# EAGLE design BEP33_2panel_v2b (EAGLE 7.7.0)
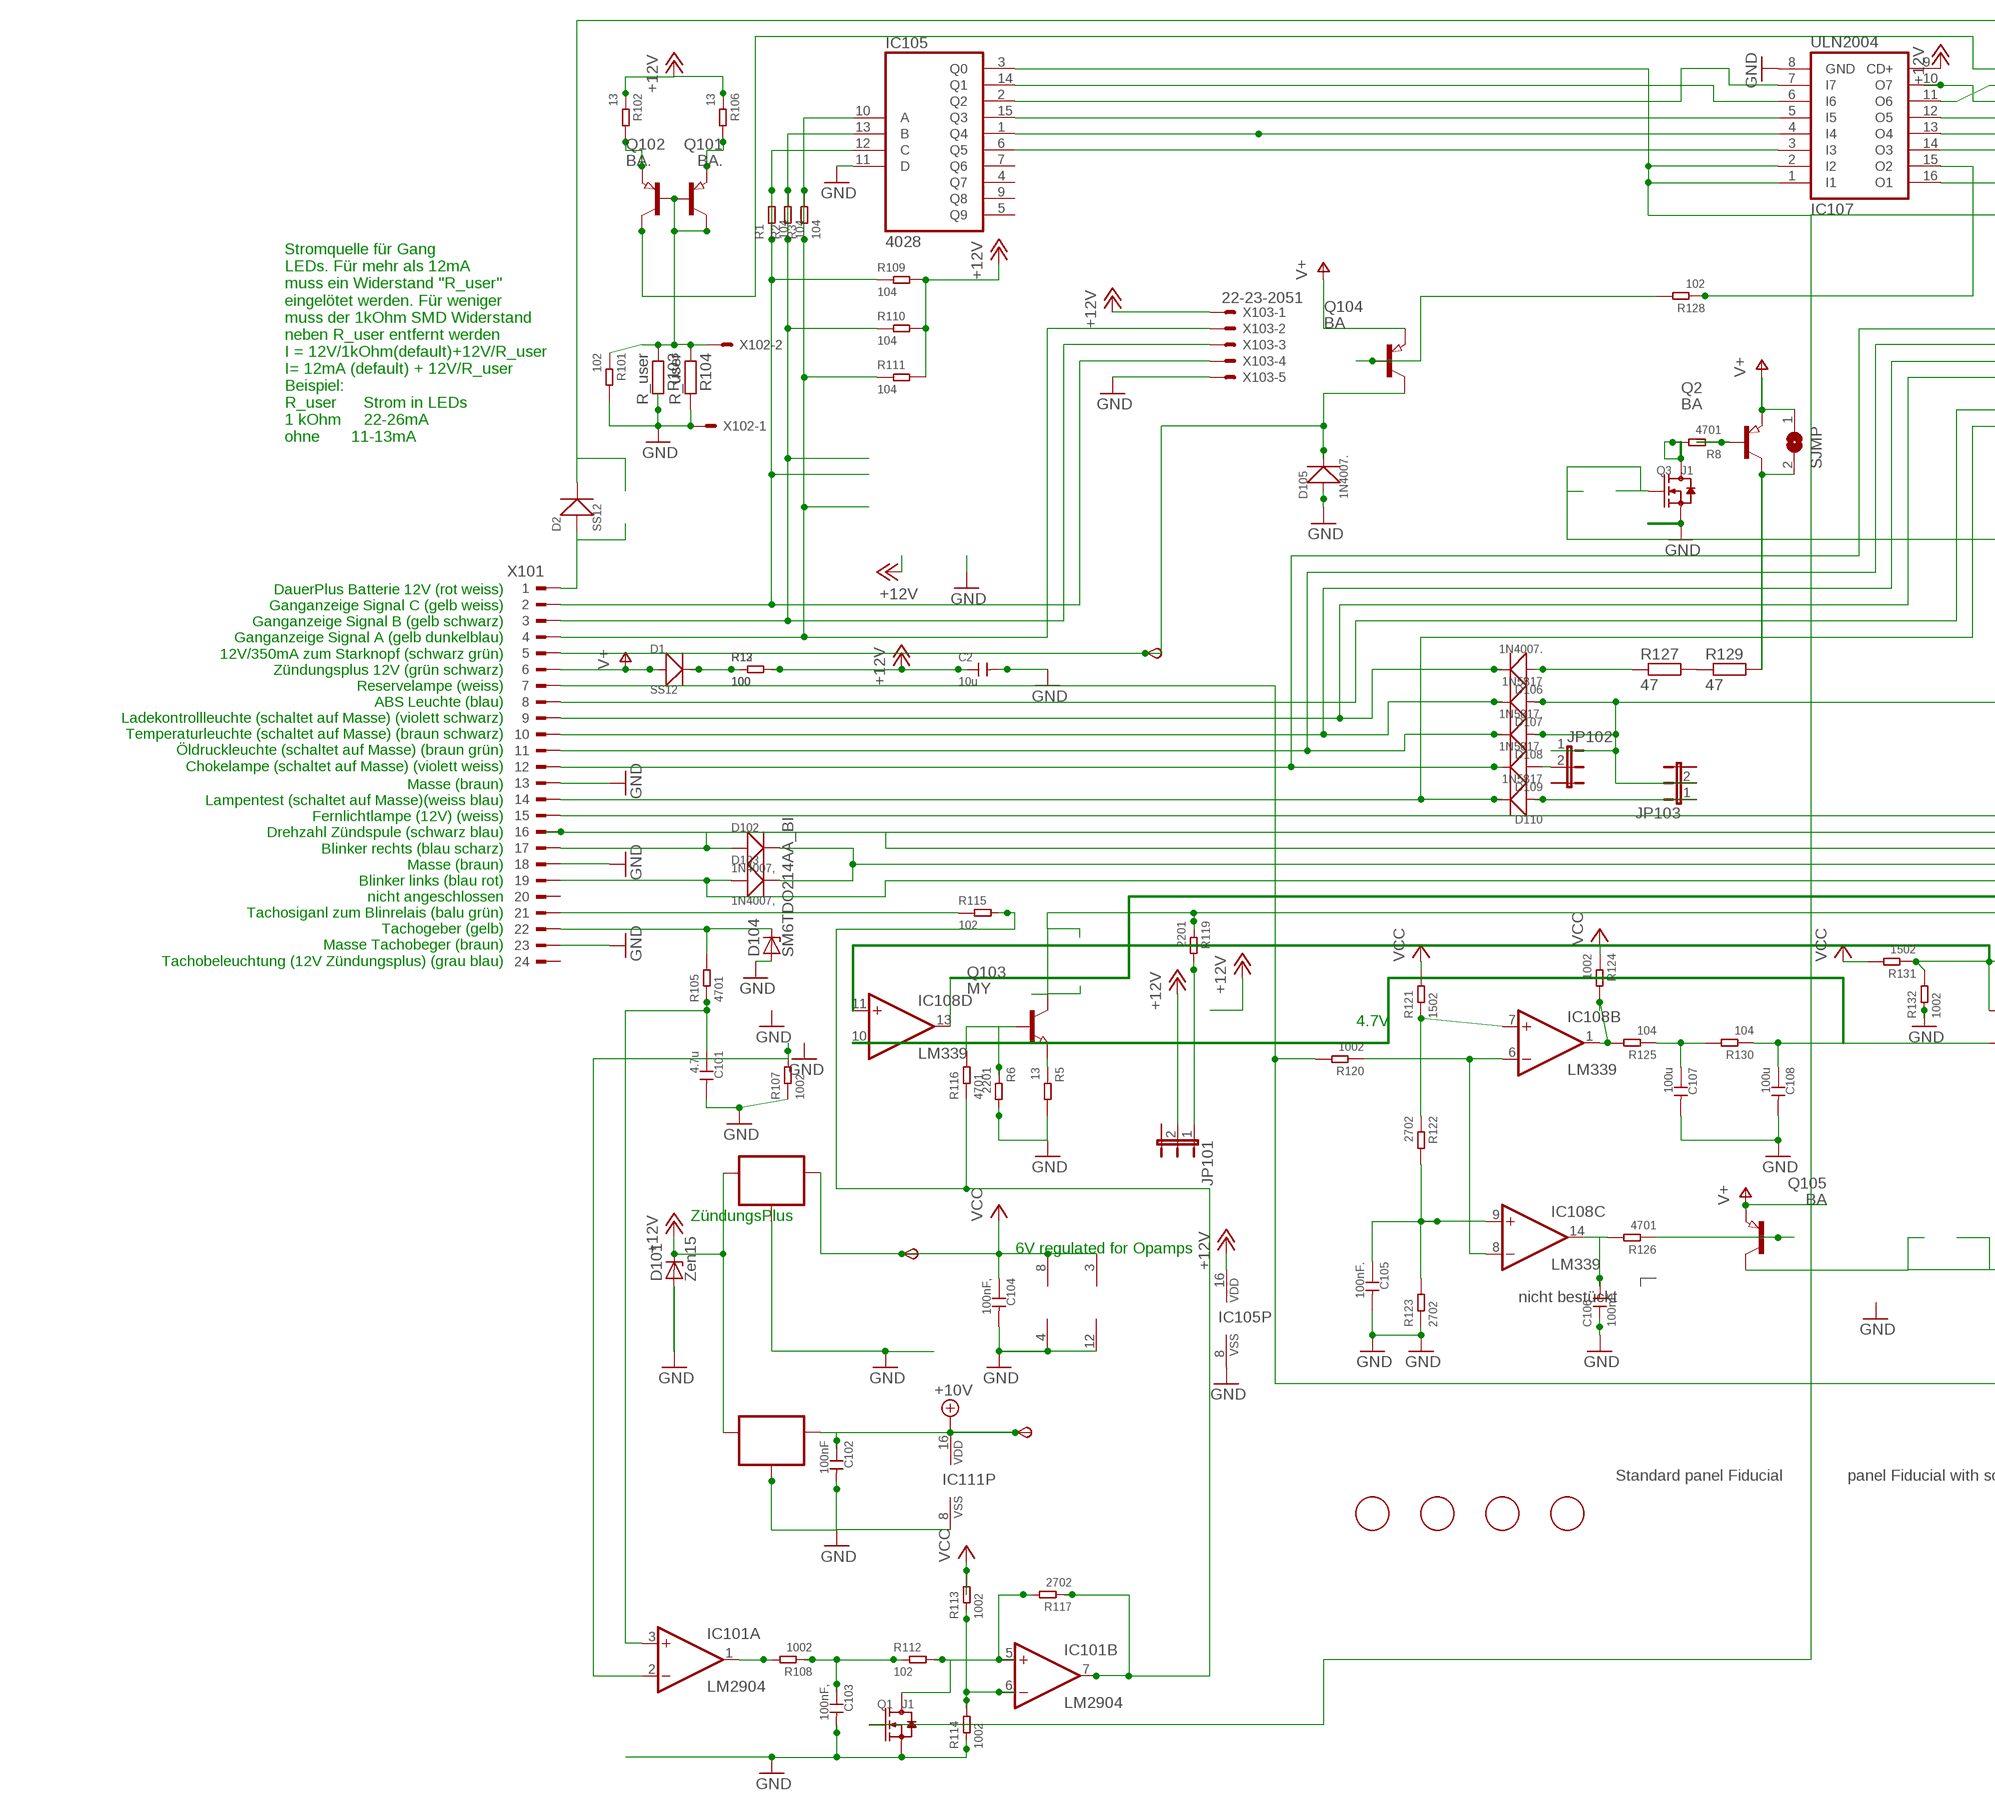
[diagram p0: schematic, sheet 1, part 1 of 2]
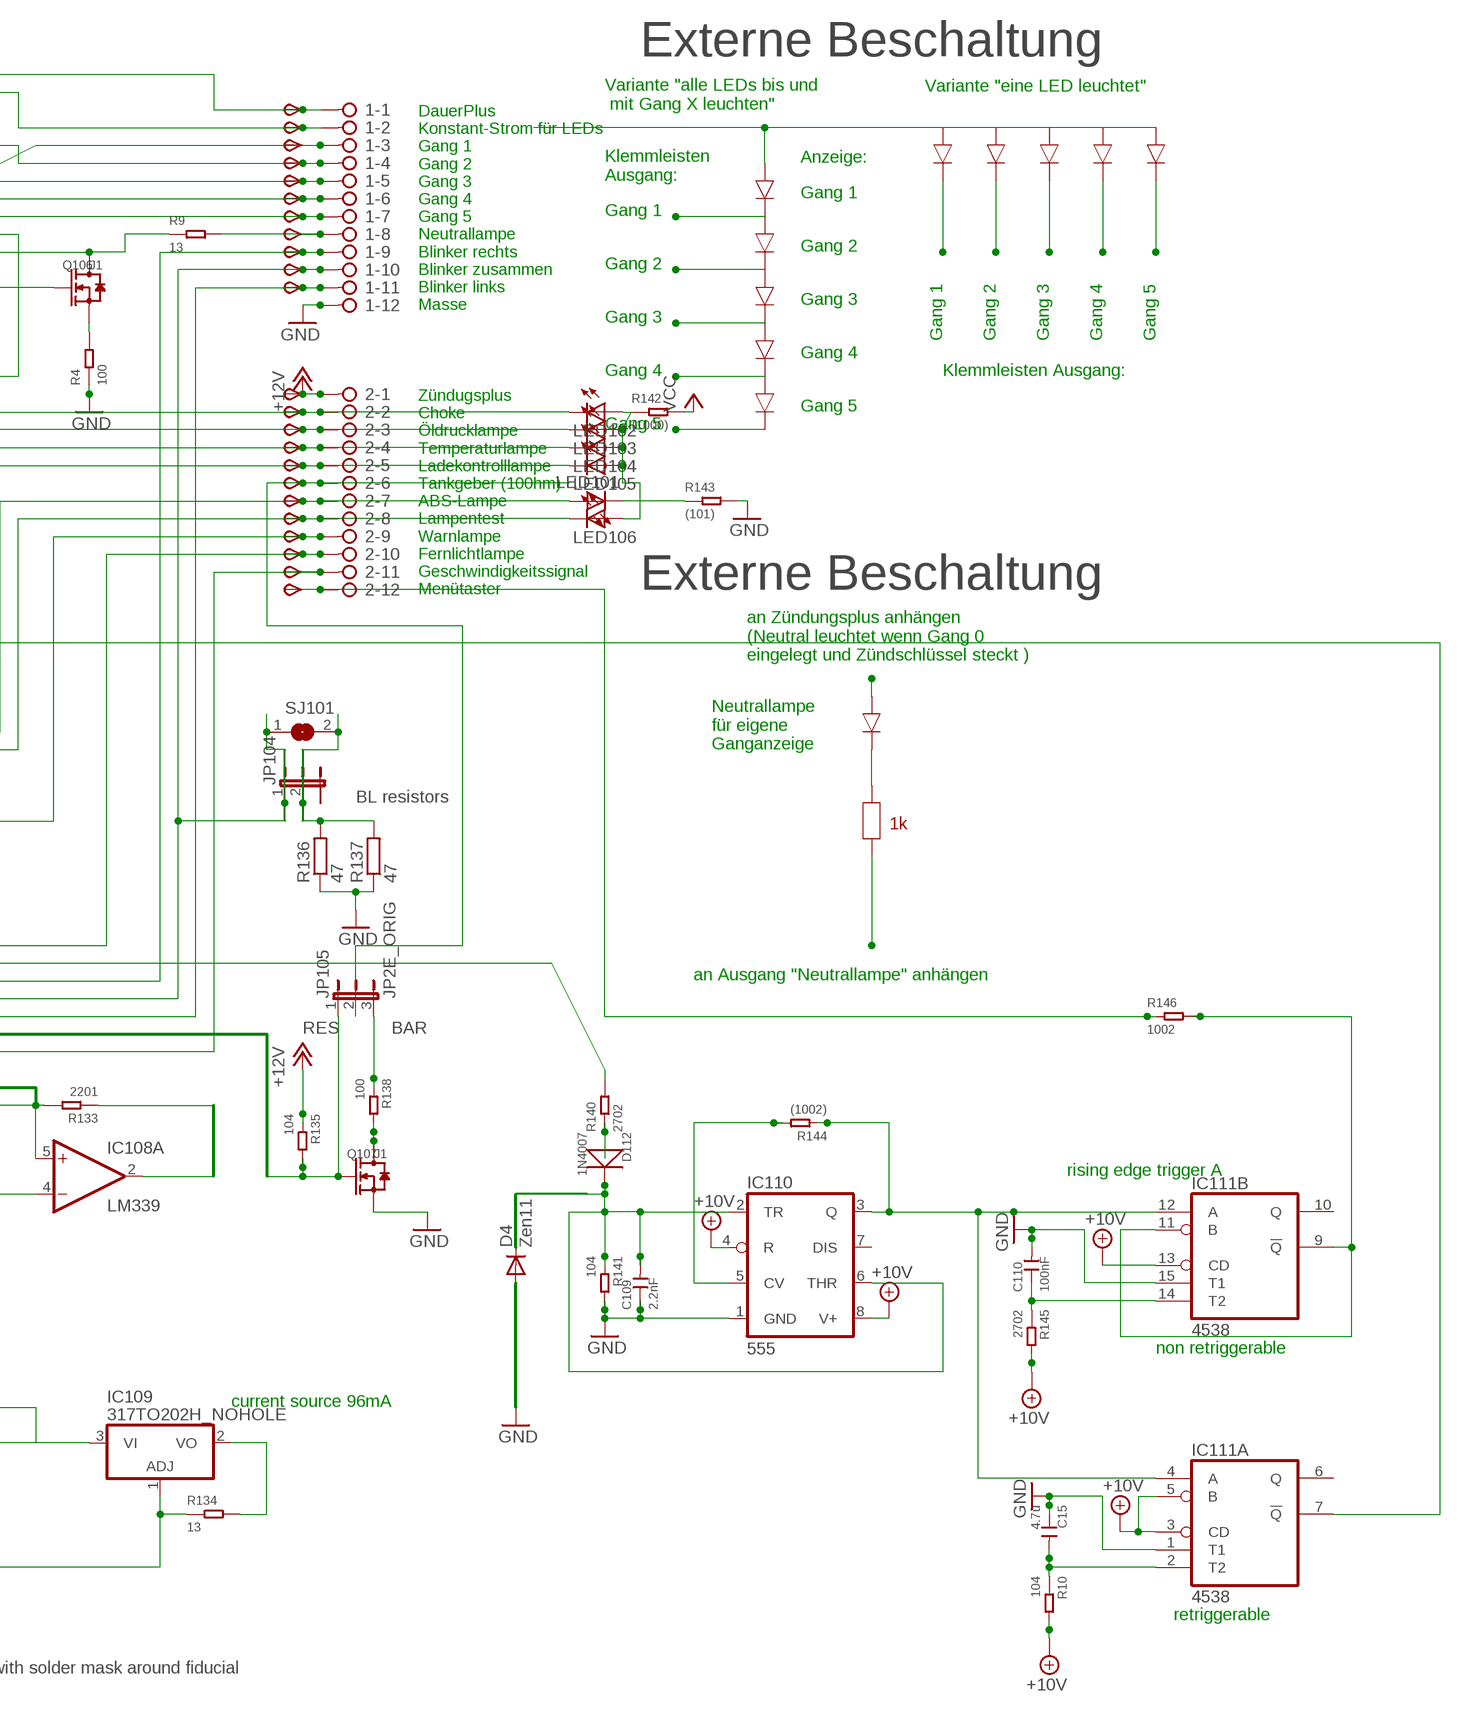
[diagram p1: schematic, sheet 1, part 2 of 2]

## Parts
1  2081-1132  [12-PIN]
2  2081-1132  [12-PIN]
6V  TPSB2.0  [B2.0]
10V  TPSB2.0  [B2.0]
C2  10u  CERAMIC-100UF-6.3V-20%-X5R(1206)  [C1206]
C15  4.7u  CERAMIC-4.7UF-25V-10%-X5R(0805)  [C0805]
C101  4.7u  CERAMIC-4.7UF-25V-10%-X5R(0805)  [C0805]
C102  100nF  CERAMIC-100NF-50V-10%-X7R(0805)  [C0805]
C103  100nF,  CERAMIC-100NF-50V-10%-X7R(0805)  [C0805]
C104  100nF,  CERAMIC-100NF-50V-10%-X7R(0805)  [C0805]
C105  100nF.  CERAMIC-100NF-50V-10%-X7R(0805)  [C0805]
C106  100nF.  CERAMIC-100NF-50V-10%-X7R(0805)  [C0805]
C107  100u  CERAMIC-100UF-6.3V-20%-X5R(1206)  [C1206]
C108  100u  CERAMIC-100UF-6.3V-20%-X5R(1206)  [C1206]
C109  2.2nF  CERAMIC-100NF-50V-10%-X7R(0805)  [C0805]
C110  100nF  CERAMIC-100NF-50V-10%-X7R(0805)  [C0805]
D1  SS12  DIODE-GEN-PURPOSE-1KV-1A(DO-214AC)DO-214AC/1206  [DO-214AC_SLIM]
D2  SS12  DIODE-GEN-PURPOSE-1KV-1A(DO-214AC)DO-214AC/1206  [DO-214AC_SLIM]
D4  Zen11  CGRM4001-G  [SOD-123_MINI-SMA]
D101  Zen15  SM6T  [DO214AA]
D102  1N4007,  DIODE-GEN-PURPOSE-1KV-1A(DO-214AC)  [DO-214AC]
D103  1N4007,  DIODE-GEN-PURPOSE-1KV-1A(DO-214AC)  [DO-214AC]
D104  SM6TDO214AA_BI  [DO214AA_BI]
D105  1N4007.  DIODE-GEN-PURPOSE-1KV-1A(DO-214AC)  [DO-214AC]
D106  1N4007.  DIODE-GEN-PURPOSE-1KV-1A(DO-214AC)  [DO-214AC]
D107  1N5817  DIODE-GEN-PURPOSE-1KV-1A(DO-214AC)DO-214AC/1206  [DO-214AC_SLIM]
D108  1N5817.  DIODE-GEN-PURPOSE-1KV-1A(DO-214AC)DO-214AC/1206  [DO-214AC_SLIM]
D109  1N5817.  DIODE-GEN-PURPOSE-1KV-1A(DO-214AC)DO-214AC/1206  [DO-214AC_SLIM]
D110  1N5817  DIODE-GEN-PURPOSE-1KV-1A(DO-214AC)DO-214AC/1206  [DO-214AC_SLIM]
D112  1N4007  DIODE-GEN-PURPOSE-1KV-1A(DO-214AC)  [DO-214AC]
FID101  FIDUCIAL  [FIDUCIAL_1MM]
FID102  FIDUCIAL  [FIDUCIAL_1MM]
FID103  FIDUCIAL  [FIDUCIAL_1MM]
FID104  FIDUCIAL  [FIDUCIAL_1MM]
IC101  LM2904  LM358D  [SO08]
IC102  78L06  78LXXSOT89_ROUND  [SOT89_ROUND]
IC104  78L10  78LXXSOT89_ROUND  [SOT89_ROUND]
IC105  4028  4028D  [SO16]
IC107  ULN2004  ULN2004AD  [SO16]
IC108  LM339  LM339D  [SO14]
IC109  317TO202H_NOHOLE  [TO220H_NOHOLE]
IC110  555  NE555D  [SO08]
IC111  4538  4538D  [SO16]
JP101  JP2EJP2_SMALLPADS  [JP2_SMALLPADS]
JP102  JP2EJP2_SMALLPADS  [JP2_SMALLPADS]
JP103  JP2EJP2_SMALLPADS  [JP2_SMALLPADS]
JP104  JP2EJP2_SMALLPADS  [JP2_SMALLPADS]
JP105  JP2E_ORIG  [JP2_ORIG_SMALLPADS]
LED101  LEDLD260  [LD260]
LED102  LEDLD260  [LD260]
LED103  LEDLD260  [LD260]
LED104  LEDLD260  [LD260]
LED105  LEDLD260  [LD260]
LED106  LEDLD260  [LD260]
Q1  J1  SMD-MOSFET-N-CH-50V-200MA-BSS138W-7-F(SOT-23)  [SOT-23]
Q2  BA  PNP-TRANSISTOR_SOT89  [SOT89]
Q3  J1  SMD-MOSFET-N-CH-50V-200MA-BSS138W-7-F(SOT-23)  [SOT-23]
Q101  BA.  PNP-TRANSISTOR_SOT89  [SOT89]
Q102  BA.  PNP-TRANSISTOR_SOT89  [SOT89]
Q103  MY  NPN-TRANSISTOR_SOT89  [SOT89]
Q104  BA  PNP-TRANSISTOR_SOT89  [SOT89]
Q105  BA  PNP-TRANSISTOR_SOT89  [SOT89]
Q106  J1  SMD-MOSFET-N-CH-50V-200MA-BSS138W-7-F(SOT-23)  [SOT-23]
Q107  J1  SMD-MOSFET-N-CH-50V-200MA-BSS138W-7-F(SOT-23)  [SOT-23]
R1  104  SMD-RES-10K-1%-1/8W(0805)  [R0805]
R2  104  SMD-RES-10K-1%-1/8W(0805)  [R0805]
R3  104  SMD-RES-10K-1%-1/8W(0805)  [R0805]
R4  100  SMD-RES-220R-5%-1/8W(0805)  [R0805]
R5  13  SMD-RES-13R-5%-1/4W(1206)  [R1206]
R6  2201  SMD-RES-1K-5%-1/8W(0805)  [R0805]
R8  4701  SMD-RES-4.7K-5%-1/8W(0805)  [R0805]
R9  13  SMD-RES-13R-5%-1/4W(1206)  [R1206]
R10  104  SMD-RES-4.7K-5%-1/8W(0805)  [R0805]
R12  100  SMD-RES-2.2K-5%-1/8W(0805)  [R0805]
R13  100  SMD-RES-2.2K-5%-1/8W(0805)  [R0805]
R101  102  SMD-RES-1K-5%-1/8W(0805)  [R0805]
R102  13  SMD-RES-13R-5%-1/4W(1206)  [R1206]
R103  R_user  R-EU_R0805  [R0805]
R104  R_user  R-EU_R0805  [R0805]
R105  4701  SMD-RES-4.7K-5%-1/8W(0805)  [R0805]
R106  13  SMD-RES-13R-5%-1/4W(1206)  [R1206]
R107  1002  SMD-RES-10K-1%-1/8W(0805)  [R0805]
R108  1002  SMD-RES-10K-1%-1/8W(0805)  [R0805]
R109  104  SMD-RES-10K-1%-1/8W(0805)  [R0805]
R110  104  SMD-RES-10K-1%-1/8W(0805)  [R0805]
R111  104  SMD-RES-10K-1%-1/8W(0805)  [R0805]
R112  102  SMD-RES-1K-5%-1/8W(0805)  [R0805]
R113  1002  SMD-RES-1K-5%-1/8W(0805)  [R0805]
R114  1002  SMD-RES-1K-5%-1/8W(0805)  [R0805]
R115  102  SMD-RES-220R-5%-1/8W(0805)  [R0805]
R116  4701  SMD-RES-4.7K-5%-1/8W(0805)  [R0805]
R117  2702  SMD-RES-4.7K-5%-1/8W(0805)  [R0805]
R119  2201  SMD-RES-2.2K-5%-1/8W(0805)  [R0805]
R120  1002  SMD-RES-10K-1%-1/8W(0805)  [R0805]
R121  1502  SMD-RES-10K-1%-1/8W(0805)  [R0805]
R122  2702  SMD-RES-4.7K-5%-1/8W(0805)  [R0805]
R123  2702  SMD-RES-4.7K-5%-1/8W(0805)  [R0805]
R124  1002  SMD-RES-10K-1%-1/8W(0805)  [R0805]
R125  104  SMD-RES-10K-1%-1/8W(0805)  [R0805]
R126  4701  SMD-RES-4.7K-5%-1/8W(0805)  [R0805]
R127  47  R-EU_V235/17_1MM  [V235/17_1MM]
R128  102  SMD-RES-1K-5%-1/8W(0805)  [R0805]
R129  47  R-EU_V235/17_1MM  [V235/17_1MM]
R130  104  SMD-RES-10K-1%-1/8W(0805)  [R0805]
R131  1502  SMD-RES-10K-1%-1/8W(0805)  [R0805]
R132  1002  SMD-RES-10K-1%-1/8W(0805)  [R0805]
R133  2201  SMD-RES-2.2K-5%-1/8W(0805)  [R0805]
R134  13  SMD-RES-13R-5%-1/4W(1206)  [R1206]
R135  104  SMD-RES-10K-1%-1/8W(0805)  [R0805]
R136  47  R-EU_V235/17_1MM  [V235/17_1MM]
R137  47  R-EU_V235/17_1MM  [V235/17_1MM]
R138  100  SMD-RES-2.2K-5%-1/8W(0805)  [R0805]
R140  2702  SMD-RES-10K-1%-1/8W(0805)  [R0805]
R141  104  SMD-RES-10K-1%-1/8W(0805)  [R0805]
R142  (1000)  SMD-RES-100R-5%-1/8W(0805)  [R0805]
R143  (101)  SMD-RES-100R-5%-1/8W(0805)  [R0805]
R144  (1002)  SMD-RES-10K-1%-1/8W(0805)  [R0805]
R145  2702  SMD-RES-4.7K-5%-1/8W(0805)  [R0805]
R146  1002  SMD-RES-4.7K-5%-1/8W(0805)  [R0805]
SJ101  SJ  [SJ]
SJMP  SJ  [SJ]
START  TPSB2.0  [B2.0]
TP1  TPSB2.0  [B2.0]
TP2  TPSB2.0  [B2.0]
TP3  TPSB2.0  [B2.0]
TP4  TPSB2.0  [B2.0]
TP5  TPSB2.0  [B2.0]
TP6  TPSB2.0  [B2.0]
TP7  TPSB2.0  [B2.0]
TP8  TPSB2.0  [B2.0]
TP9  TPSB2.0  [B2.0]
TP10  TPSB2.0  [B2.0]
TP11  TPSB2.0  [B2.0]
TP12  TPSB2.0  [B2.0]
TP13  TPSB2.0  [B2.0]
TP16  TPSB2.0  [B2.0]
TP17  TPSB2.0  [B2.0]
TP18  TPSB2.0  [B2.0]
TP19  TPSB2.0  [B2.0]
TP21  TPSB2.0  [B2.0]
TP22  TPSB2.0  [B2.0]
TP23  TPSB2.0  [B2.0]
TP24  TPSB1,27  [B1,27]
TP25  TPSB2.0  [B2.0]
TP26  TPSB2.0  [B2.0]
X101  CON_BMWV2  [24-PIN_V2]
X102  22-23-2021  [22-23-2021]
X103  22-23-2051  [22-23-2051]

## Nets
+10V: 10V.TP(PP) C102.1 IC104.1(OUT) IC110.4(R) IC110.8(V+) IC111.3(A:CD) IC111.5(A:B) IC111.13(B:CD) IC111.16(P:VDD) R10.2 R145.2
+12V: 2.1 C2.1 D101.C IC102.3(IN) IC104.3(IN) IC105.16(VDD) IC107.9(CD+) JP101.2 R12.2 R13.2 R102.1 R106.1 R109.2 R110.2 R111.2 R135.1 TP12.TP(PP) X103.1
+12V1: 2.11 Q103.2(C) R119.1 TP26.TP(PP)
GND: 1.12 C2.2 C15.1 C101.2 C102.2 C103.2 C104.2 C105.2 C106.1 C107.2 C108.2 C109.1 C110.2 D4.A D101.A D104.A D105.1(+) IC101.4(P:V-) IC102.2(GND) IC102.2@1(GND) IC104.2(GND) IC104.2@1(GND) IC105.8(VSS) IC105.11(D) IC107.8(GND) IC108.12(P:GND) IC110.1(GND) IC111.1(A:T1) IC111.8(P:VSS) IC111.15(B:T1) Q1.2(S) Q3.2(S) Q107.2(S) R4.1 R5.2 R6.2 R101.2 R103.2 R104.2 R107.1 R114.1 R123.1 R132.1 R136.1 R137.1 R141.2 R143.2 X101.13 X101.18 X101.23 X102.1 X103.5
N$1: 2.9 D107.1(+) D108.1(+) JP102.1 JP103.2 TP24.TP(PP)
N$2: IC105.10(A) R3.1 R3.2 R111.1 X101.4 X103.2
N$3: IC105.13(B) R2.1 R2.2 R110.1 X101.3 X103.3
N$4: 2.7 LED101.A TP22.TP(PP) X101.8
N$5: Q101.3(E) R102.2
N$6: Q2.1(B) R8.1
N$7: IC101.2(A:-IN) R107.2
N$8: R127.2 R129.1
N$9: Q102.3(E) R106.2
N$11: D105.2(-) Q104.2(C) START.TP(PP) X101.5
N$12: 2.2 D109.2(-) LED102.K(C) TP16.TP(PP) X101.12
N$13: 2.3 D108.2(-) LED103.K(C) TP17.TP(PP) X101.11
N$14: 2.4 D107.2(-) LED104.K(C) TP18.TP(PP) X101.10
N$15: IC109.3(VI) Q105.2(C)
N$16: IC108.6(B:-IN) IC108.8(C:-IN) R120.1
N$17: IC105.12(C) R1.1 R1.2 R109.1 X101.2 X103.4
N$18: IC105.15(Q3) IC107.5(I5)
N$19: 2.8 D110.2(-) LED106.K(C) TP23.TP(PP) X101.14
N$20: 1.9 D102.1(+) TP9.TP(PP) X101.17
N$21: 1.11 D103.1(+) TP11.TP(PP) X101.19
N$22: IC111.9(B:!Q) IC111.11(B:B) R146.2
N$23: D104.C R105.2 X101.22
N$24: C101.1 IC101.3(A:+IN) R105.1
N$25: 1.6 IC107.13(O4) TP6.TP(PP)
N$26: 1.7 IC107.14(O3) TP7.TP(PP)
N$27: D1.2(-) R12.1 R13.1
N$28: 2.6 JP105.2 TP21.TP(PP)
N$29: JP101.1 R119.2
N$30: C105.1 IC108.9(C:+IN) R122.2 R123.2
N$31: C106.2 IC108.14(C:OUT) R126.2
N$32: Q3.3(D) R8.2
N$34: LED101.K(C) R143.1
N$35: IC109.1(ADJ) R120.2 R134.1 X101.7
N$36: Q105.1(B) R126.1
N$37: IC105.2(Q2) IC107.7(I7)
N$38: 1.3 IC107.11(O6) TP3.TP(PP)
N$39: 1.5 IC107.12(O5) TP5.TP(PP)
N$41: LED102.A LED103.A LED104.A LED105.A LED106.A R142.1
N$42: R140.2 X101.16
N$43: Q104.1(B) R128.2
N$44: IC105.3(Q0) IC107.1(I1) IC107.2(I2) Q1.1(G) Q106.1(G)
N$45: C107.1 R125.1 R130.2
N$46: C108.1 IC108.4(A:-IN) IC108.10(D:-IN) R130.1
N$47: IC108.5(A:+IN) IC108.11(D:+IN) R131.1 R132.2 R133.2
N$48: Q107.3(D) R138.2
N$49: IC111.7(A:!Q) Q3.1(G)
N$50: IC105.1(Q4) IC107.4(I4)
N$51: R115.1 X101.21
N$52: IC107.16(O1) Q106.3(D) R9.1
N$53: 2.10 TP25.TP(PP) X101.15
N$54: D106.1(+) R127.1
N$55: 2.5 D106.2(-) LED105.K(C) TP19.TP(PP) X101.9
N$56: IC105.14(Q1) IC107.6(I6)
N$57: Q101.1(B) Q102.1(B) Q102.2(C) R101.1 R103.1 R104.1 X102.2
N$58: 1.8 R9.2 TP8.TP(PP)
N$59: 1.2 Q101.2(C) TP2.TP(PP)
N$60: IC108.13(D:OUT) JP105.1 Q107.1(G) R135.2
N$61: IC105.6(Q5) IC107.3(I3)
N$64: IC109.2(VO) R134.2
N$65: IC110.5(CV) R144.2
N$67: 1.4 IC107.10(O7) TP4.TP(PP)
N$69: 1.1 D2.2(-) TP1.TP(PP)
N$83: IC108.7(B:+IN) R121.1 R122.1
N$84: Q106.2(S) R4.2
N$85: Q103.1(B) R6.1 R116.2
N$86: IC110.3(Q) IC111.4(A:A) IC111.12(B:A) R144.1
N$87: D112.1(+) R140.1
N$88: IC107.15(O2) R128.1
N$89: C110.1 IC111.14(B:T2) R145.1
N$90: 2.12 R146.1 TP13.TP(PP)
N$91: D2.1(+) X101.1
N$92: IC101.1(A:OUT) R108.2
N$93: 1.10 D102.2(-) D103.2(-) JP104.1 SJ101.1 TP10.TP(PP)
N$94: JP104.2 R136.2 R137.2 SJ101.2
N$95: D109.1(+) JP102.2
N$96: C103.1 R108.1 R112.1
N$97: IC101.5(B:+IN) Q1.3(D) R112.2 R117.2
N$98: D110.1(+) JP103.1
N$99: JP105.3 R138.1
N$100: Q103.3(E) R5.1
N$101: IC101.6(B:-IN) R113.1 R114.2
N$102: C109.2 D4.C D112.2(-) IC110.2(TR) IC110.6(THR) R141.1
N$103: C15.2 IC111.2(A:T2) R10.1
N$104: Q2.2(C) R129.2 SJMP.2
N$107: IC101.7(B:OUT) R115.2 R116.1 R117.1
N$108: IC108.2(A:OUT) R133.1
N$580: IC108.1(B:OUT) R124.2 R125.2
V+: D1.1(+) Q2.3(E) Q104.3(E) Q105.3(E) SJMP.1 X101.6
VCC: 6V.TP(PP) C104.1 IC101.8(P:V+) IC102.1(OUT) IC108.3(P:V+) R113.2 R121.2 R124.1 R131.2 R142.2
Unconnected: IC105.4(Q7) IC105.5(Q9) IC105.7(Q6) IC105.9(Q8) IC110.7(DIS) IC111.6(A:Q) IC111.10(B:Q) X101.20 X101.24

## Notes on the sheet
- Externe Beschaltung
- Variante "eine LED leuchtet"
- Variante "alle LEDs bis und
   mit Gang X leuchten"
- Anzeige:
- Klemmleisten
  Ausgang:
- Gang 1
- DauerPlus
  Konstant-Strom für LEDs
  Gang 1
  Gang 2
  Gang 3
  Gang 4
  Gang 5
  Neutrallampe
  Blinker rechts
  Blinker zusammen
  Blinker links
  Masse
- Gang 1
- Gang 2
- Gang 2
- Gang 3
- Gang 3
- Gang 1 | Gang 2 | Gang 3 | Gang 4 | Gang 5
- Gang 4
- Gang 4 | Klemmleisten Ausgang:
- Gang 5
- Gang 5
- Zündugsplus
  Choke
  Öldrucklampe
  Temperaturlampe
  Ladekontrolllampe
  Tankgeber (100hm)
  ABS-Lampe
  Lampentest
  Warnlampe
  Fernlichtlampe
  Geschwindigkeitssignal
  Menütaster
- Stromquelle für Gang
  LEDs. Für mehr als 12mA
  muss ein Widerstand "R_user"
  eingelötet werden. Für weniger
  muss der 1kOhm SMD Widerstand
  neben R_user entfernt werden
  I = 12V/1kOhm(default)+12V/R_user
  I= 12mA (default) + 12V/R_user
  Beispiel:
  R_user      Strom in LEDs
  1 kOhm     22-26mA
  ohne       11-13mA
- Externe Beschaltung
- an Zündungsplus anhängen
  (Neutral leuchtet wenn Gang 0
  eingelegt und Zündschlüssel steckt )
- Neutrallampe
  für eigene
  Ganganzeige
- DauerPlus Batterie 12V (rot weiss)
  Ganganzeige Signal C (gelb weiss)
  Ganganzeige Signal B (gelb schwarz)
  Ganganzeige Signal A (gelb dunkelblau)
  12V/350mA zum Starknopf (schwarz grün)
  Zündungsplus 12V (grün schwarz)
  Reservelampe (weiss)
  ABS Leuchte (blau)
  Ladekontrollleuchte (schaltet auf Masse) (violett schwarz)
  Temperaturleuchte (schaltet auf Masse) (braun schwarz)
  Öldruckleuchte (schaltet auf Masse) (braun grün)
  Chokelampe (schaltet auf Masse) (violett weiss)
- BL resistors
- 1k
- an Ausgang "Neutrallampe" anhängen
- Masse (braun)
  Lampentest (schaltet auf Masse)(weiss blau)
  Fernlichtlampe (12V) (weiss)
  Drehzahl Zündspule (schwarz blau)
  Blinker rechts (blau scharz)
  Masse (braun)
  Blinker links (blau rot)
  nicht angeschlossen
  Tachosiganl zum Blinrelais (balu grün)
  Tachogeber (gelb)
  Masse Tachobeger (braun)
  Tachobeleuchtung (12V Zündungsplus) (grau blau)
- RES | BAR
- 4.7V | rising edge trigger A
- non retriggerable
- ZündungsPlus
- current source 96mA
- 6V regulated for Opamps
- nicht bestückt
- retriggerable
- Standard panel Fiducial | panel Fiducial with solder mask around fiducial

## Library data of the parts
1 2 = con WAGO BMW:2081-1132: WAGO SREW CLAMP
6V 10V START TP1-TP13 TP16-TP19 TP21-TP26 = testpin_BMW:TPS: TEST PIN
C2 C107 C108 = Seeed-Capacitor-2016:CERAMIC-100UF-6.3V-20%-X5R(1206): 302010183; MPN: GRM31CR60J107ME39L; VALUE: 100uf
C15 C101 = Seeed-Capacitor-2016:CERAMIC-4.7UF-25V-10%-X5R(0805): 302010146; MPN: CC0805KKX5R8BB475; VALUE: 4.7uf
C102-C106 C109 C110 = Seeed-Capacitor-2016:CERAMIC-100NF-50V-10%-X7R(0805): 302010165; MPN: CC0805KRX7R9BB104; VALUE: 100nf
D1 D2 D107-D110 = Diode-do214ac:DIODE-GEN-PURPOSE-1KV-1A(DO-214AC): 304010013
D4 = diode:CGRM400*-G: Molded plasitc,JEDEC SOD-123/Mini SMA Source: Comchip CGRM4001-G.pdf
D101 D104 = Suppressor_Diode_DO214AA:SM6T: Z DIODE
D102 D103 D105 D106 = Diode-do214ac:DIODE-GEN-PURPOSE-1KV-1A(DO-214AC): 304010013; MPN: 1N4007; VALUE: 1N4007
D112 = Diode-do214ac:DIODE-GEN-PURPOSE-1KV-1A(DO-214AC): 304010013; MPN: 1N4007
FID101-FID104 = Fiducial:FIDUCIAL: For use by pick and place machines to calibrate the vision/machine, 1mm By microbuilder.eu
IC101 = linear_BMW:LM358: OP AMP also LM158; LM258; LM2904 Source: http://cache.national.com/ds/LM/LM158.pdf
IC102 IC104 = 78LXX:78LXX
IC105 = 4028:4028: BCD to decimal DECODER
IC107 = uln-udn:ULN2004A: DRIVER ARRAY
IC108 = LM339:LM339: Low Power Low Offset Voltage Quad Comparators with open collector; LM139/LM239/LM339/LM2901/LM3302
IC109 = linear_BMW:*317: Positive VOLTAGE REGULATOR
IC110 = linear:*555: TIMER
IC111 = 45xx:4538: Dual precision monostable MULTIVIBRATOR
JP101-JP104 = Switch Aliexpress 2:JP2E: JUMPER
JP105 = Switch Aliexpress 2:JP2E_ORIG
LED101-LED106 = led:LED: LED OSRAM: - CHIPLED LG R971, LG N971, LY N971, LG Q971, LY Q971, LO R971, LY R971 LH N974, LH R974 LS Q976, LO Q976, LY Q976 LO Q996 - Hyper CHIPLED LW Q18S LB Q993, LB Q99A, LB R99A - SideLED LS A670, LO A670, LY A670, LG A670, LP A670 LB A673, LV A673, LT A673, LW A673 LH A674 LY A675 LS A676, LA A676, LO A676, LY A676, LW A676 LS A679, LY A679, LG A679 - Hyper Micro SIDELED® LS Y876, LA Y876, LO Y876, LY Y876 LT Y87S - SmartLED LW L88C, LW L88S LB L89C, LB L89S, LG L890 LS L89K, LO L89K, LY L89K LS L896, LA L896, LO L896, LY L896 - TOPLED LS T670, LO T670, LY T670, LG T670, LP T670 LSG T670, LSP T670, LSY T670, LOP T670, LYG T670 LG T671, LOG T671, LSG T671 LB T673, LV T673, LT T673, LW T673 LH T674 LS T676, LA T676, LO T676, LY T676, LB T676, LH T676, LSB T676, LW T676 LB T67C, LV T67C, LT T67C, LS T67K, LO T67K, LY T67K, LW E67C LS E67B, LA E67B, LO E67B, LY E67B, LB E67C, LV E67C, LT E67C LW T67C LS T679, LY T679, LG T679 LS T770, LO T770, LY T770, LG T770, LP T770 LB T773, LV T773, LT T773, LW T773 LH T774 LS E675, LA E675, LY E675, LS T675 LS T776, LA T776, LO T776, LY T776, LB T776 LHGB T686 LT T68C, LB T68C - Hyper Mini TOPLED® LB M676 - Mini TOPLED Santana® LG M470 LS M47K, LO M47K, LY M47K Source: http://www.osram.convergy.de LUXEON: - LUMILED® LXK2-PW12-R00, LXK2-PW12-S00, LXK2-PW14-U00, LXK2-PW14-V00 LXK2-PM12-R00, LXK2-PM12-S00, LXK2-PM14-U00 LXK2-PE12-Q00, LXK2-PE12-R00, LXK2-PE12-S00, LXK2-PE14-T00, LXK2-PE14-U00 LXK2-PB12-K00, LXK2-PB12-L00, LXK2-PB12-M00, LXK2-PB14-N00, LXK2-PB14-P00, LXK2-PB14-Q00 LXK2-PR12-L00, LXK2-PR12-M00, LXK2-PR14-Q00, LXK2-PR14-R00 LXK2-PD12-Q00, LXK2-PD12-R00, LXK2-PD12-S00 LXK2-PH12-R00, LXK2-PH12-S00 LXK2-PL12-P00, LXK2-PL12-Q00, LXK2-PL12-R00 Source: www.luxeon.com KINGBRIGHT: KA-3528ASYC Source: www.kingbright.com
Q1 Q3 Q106 Q107 = Seeed-Transistor-2016:SMD-MOSFET-N-CH-50V-200MA-BSS138W-7-F(SOT-23): 305030000; MPN: BSS138W-7-F; VALUE: BSS138W-7-F
Q2 Q101 Q102 Q104 Q105 = Transistor_SOT89:PNP-TRANSISTOR_: PNP TRANSISTOR
Q103 = Transistor_SOT89:NPN-TRANSISTOR_: NPN TRANSISTOR
R1-R3 R107-R111 R120 R121 R124 R125 R130-R132 R135 R140 R141 R144 = Seeed-Resistor-2016:SMD-RES-10K-1%-1/8W(0805): 301010361; MPN: RC0805FR-0710KL; VALUE: 10K
R4 R115 = Seeed-Resistor-2016:SMD-RES-220R-5%-1/8W(0805): 301010315; MPN: RC0805JR-07220RL; VALUE: 220R
R5 R9 R102 R106 R134 = Seeed-Resistor-2016:SMD-RES-13R-5%-1/4W(1206): 301010405; MPN: RC1206JR-0713RL; VALUE: 13R
R6 R101 R112-R114 R128 = Seeed-Resistor-2016:SMD-RES-1K-5%-1/8W(0805): 301010311; MPN: RC0805JR-071KL; VALUE: 1K
R8 R10 R105 R116 R117 R122 R123 R126 R145 R146 = Seeed-Resistor-2016:SMD-RES-4.7K-5%-1/8W(0805): 301010306; MPN: RC0805JR-074K7L; VALUE: 4.7K
R12 R13 R119 R133 R138 = Seeed-Resistor-2016:SMD-RES-2.2K-5%-1/8W(0805): 301010333; MPN: RC0805JR-072K2L; VALUE: 2.2K
R103 R104 R127 R129 R136 R137 = rcl:R-EU_: RESISTOR, European symbol
R142 R143 = Seeed-Resistor-2016:SMD-RES-100R-5%-1/8W(0805): 301010319; MPN: RC0805JR-07100RL; VALUE: 100R
SJ101 = solder-jumper:SJ: SMD solder JUMPER
SJMP = jumper:SJ: SMD solder JUMPER
X101 = con_BMW:CON_BMW: BMW CONNECTOR
X102 = con_Molex_BMW:22-23-2021: .100" (2.54mm) Center Header - 2 Pin; MF: MOLEX; MPN: 22-23-2021; OC_FARNELL: 1462926; OC_NEWARK: 25C3832
X103 = con_Molex_BMW:22-23-2051: .100" (2.54mm) Center Header - 5 Pin; MF: MOLEX; MPN: 22-23-2051; OC_FARNELL: 1462952; OC_NEWARK: 38C9178

## Board
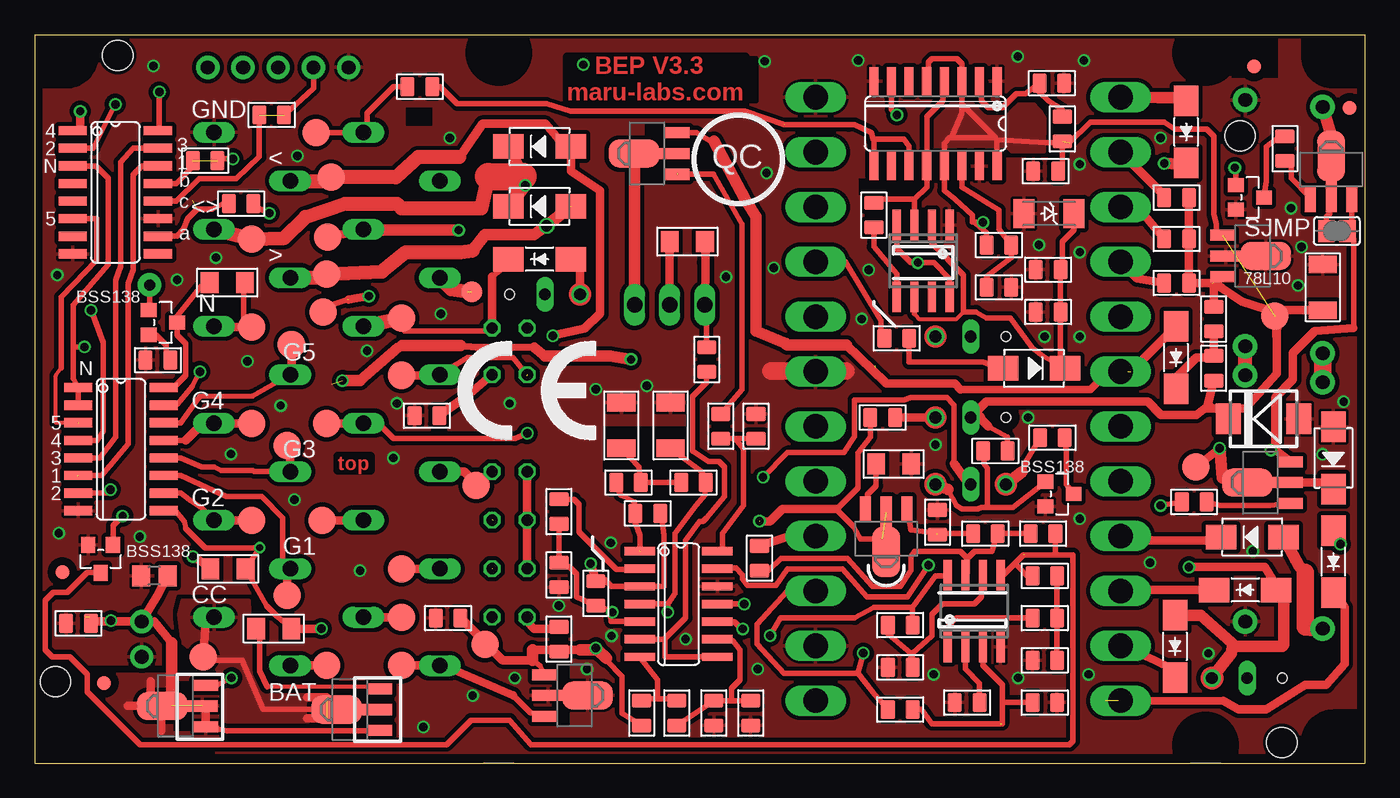
[diagram p2: board, top side]
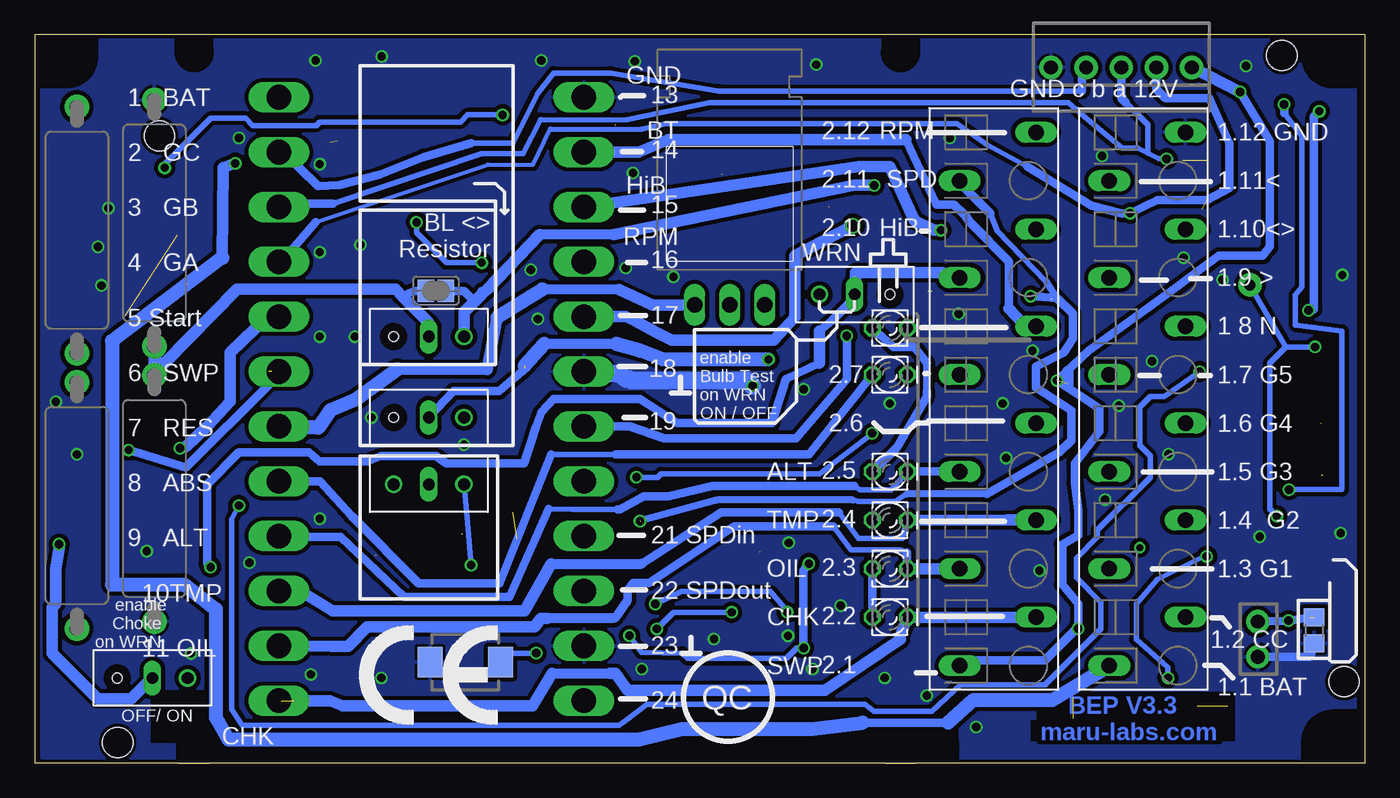
[diagram p3: board, bottom side, seen from below]

Size 96 x 52.6 mm. Coordinates in mm from the lower left corner, seen from the top.
Outline: 0,0 96,0 96,52.6 0,52.6 0,0
Copper layers (1*16): Top 0.035mm / dielectric 1.5mm / Bottom 0.035mm
Design rules "Vorlage BEP3 und hoeher multi-cb_035um-cu": minimum track width 6mil, minimum drill 12mil, track to track 12mil, track to pad 12mil, pad to pad 6mil, via to via 6mil, smd to smd 6mil, copper to edge 10mil, drill to drill 8mil, minimum pad ring 8mil, minimum via ring 6mil, stop-mask expansion 3mil, vias tented up to drill 0mil, thermal gap 8mil
Holes 2.18 mm at 1.5,5.9 87,45.3 90,1.5 6,51.1
tRestrict: area 41,21 to 47.5,24.3; area 26.8,46 to 28.7,47.3; area 58.4,16.6 to 60.2,18.6; area 44.1,41.9 to 45.5,46.2; area 37.3,2.7 to 38.6,7.2; area 10,2.4 to 11.4,5.9; area 88.4,22.4 to 90,23.6; area 86.4,49.5 to 89.7,52.2; area 59.5,41 to 63.7,42.2; area 13.4,34 to 14.5,35.7; area 7.3,52.6 to 82,52.6; area 38.4,47.8 to 52.1,50.9; 6 more areas
bRestrict: area 9.4,1.6 to 19.6,5.1; area 19.5,1.6 to 24.1,3.1; area 29.3,0.9 to 35.8,3.1; area 81.6,1.5 to 87.6,5.3; area 32.3,50.1 to 34.7,52.5; area 32.1,51.2 to 34.9,52.6; area 83.3,50.1 to 85.7,52.5; area 83.1,51.2 to 85.9,52.6; area 83.2,0 to 85.8,2.6; area 32.2,0 to 34.8,2.7; area 29.3,0 to 36.4,1.7; area 91.6,48.9 to 95.8,52.6; 2 more areas
Milling: 2 lines

### Footprints (pad centres in the part's own frame; a part is rotated, then mirrored left to right if it is on the bottom)
12-PIN = drill 1.118 long: 1 19.25,-2.45; 2 15.75,3.05; 3 12.25,-2.45; 4 8.75,3.05; 5 5.25,-2.45; 6 1.75,3.05; 7 -1.75,-2.45; 8 -5.25,3.05; 9 -8.75,-2.45; 10 -12.25,3.05; 11 -15.75,-2.45; 12 -19.25,3.05
B2.0 = smd 2 x 2: TP 0,0
C1206 = smd 1.27 x 2.032: 1 -1.651,0; 2 1.651,0
C0805 = smd 1.397 x 1.016: 1 0,0.889; 2 0,-0.889
DO-214AC_SLIM = smd 2.2 x 1.77: 1 -2.242,0; 2 2.242,0
SOD-123_MINI-SMA = smd 1.5 x 2.1: A 1.8,0; C -1.8,0
DO214AA = smd 1.8 x 2.2: A 2.55,0; C -2.55,0
DO-214AC = smd 2.2 x 1.77: 1 -2.242,0; 2 2.242,0
DO214AA_BI = smd 1.8 x 2.2: A 2.45,0; C -2.65,0
FIDUCIAL_1MM = smd 1 x 1: 1 0,0
SO08 = smd 0.6 x 2.2: 1 -1.905,-2.6; 2 -0.635,-2.6; 3 0.635,-2.6; 4 1.905,-2.6; 5 1.905,2.6; 6 0.635,2.6; 7 -0.635,2.6; 8 -1.905,2.6
SOT89_ROUND = smd 0.8 x 1.8: 1 -1.499,-2.181; 3 1.499,-2.181 | smd 0.8 x 2.3: 2 0,-1.927 | smd 2.032 x 3.65: 2@1 0,0.94
SO16 = smd 0.66 x 2.032: 1 -4.445,-3.073; 2 -3.175,-3.073; 3 -1.905,-3.073; 4 -0.635,-3.073; 5 0.635,-3.073; 6 1.905,-3.073; 7 3.175,-3.073; 8 4.445,-3.073; 9 4.445,3.073; 10 3.175,3.073; 11 1.905,3.073; 12 0.635,3.073; 13 -0.635,3.073; 14 -1.905,3.073; 15 -3.175,3.073; 16 -4.445,3.073
SO14 = smd 0.6 x 2.2: 1 -3.81,-2.8; 2 -2.54,-2.8; 3 -1.27,-2.8; 4 0,-2.8; 5 1.27,-2.8; 6 2.54,-2.8; 7 3.81,-2.8; 8 3.81,2.8; 9 2.54,2.8; 10 1.27,2.8; 11 0,2.8; 12 -1.27,2.8; 13 -2.54,2.8; 14 -3.81,2.8
TO220H_NOHOLE = drill 1.118 long: 1 -2.54,-10.16; 2 0,-10.16; 3 2.54,-10.16
JP2_SMALLPADS = drill 0.85: 1 -2.54,0 | drill 0.85 long: 2 0,0 | hole 0.7: 2.54,0
JP2_ORIG_SMALLPADS = drill 0.85: 1 -2.54,0; 3 2.54,0 | drill 0.85 long: 2 0,0
LD260 = drill 0.813 octagon: A -1.27,0; K 1.27,0
SOT-23 = smd 1.016 x 1.143: 1 -0.889,-1.016; 2 0.889,-1.016; 3 0,1.016
SOT89 = smd 0.8 x 1.8: 1 -1.499,-2.181; 3 1.499,-2.181 | smd 0.8 x 2.3: 2 0,-1.927 | smd 2.032 x 3.65: 2@1 0,0.94
R0805 = smd 1.397 x 1.016: 1 0,0.889; 2 0,-0.889
R1206 = smd 1.27 x 1.524: 1 -1.27,0; 2 1.27,0
R0805' = smd 1.3 x 1.5: 1 -0.95,0; 2 0.95,0
V235/17_1MM = drill 1 pad 1.778: 1 -8.89,0; 2 8.89,0
SJ = smd 1.2 x 1.6: 1 -0.725,0; 2 0.725,0
SJ' = smd 1.168 x 1.6: 1 -0.762,0; 2 0.762,0
B1,27 = smd 1.5 x 1.5: TP 0,0
24-PIN_V2 = drill 1.778 long: 1 -21.78,-11; 2 -17.82,-11; 3 -13.86,-11; 4 -9.9,-11; 5 -5.94,-11; 6 -1.98,-11; 7 1.98,-11; 8 5.94,-11; 9 9.9,-11; 10 13.86,-11; 11 17.82,-11; 12 21.78,-11; 13 -21.78,11; 14 -17.82,11; 15 -13.86,11; 16 -9.9,11; 17 -5.94,11; 18 -1.98,11; 19 1.98,11; 20 5.94,11; 21 9.9,11; 22 13.86,11; 23 17.82,11; 24 21.78,11
22-23-2021 = drill 1 pad 1.676: 1 -1.27,0; 2 1.27,0
22-23-2051 = drill 1 pad 1.676: 1 -5.08,0; 2 -2.54,0; 3 0,0; 4 2.54,0; 5 5.08,0

### Placement (x,y rotation side)
1  15.99,26.3 270 bottom
2  26.79,26.3 270 bottom
6V  32.5,8.58 0 top
10V  89.5,32.3 0 top
C2  92.96,34.36 90 top
C15  73.41,49.09 270 top
C101  72.9,4.39 90 top
C102  72.96,42.75 270 top
C103  72.9,7.44 270 top
C104  29.83,10.48 270 top
C105  49.01,3.63 0 top
C106  52.06,24.33 0 top
C107  42.34,24.39 90 top
C108  45.9,24.39 90 top
C109  73.14,32.58 90 top
C110  69.58,34.36 90 top
D1  82.36,29.29 270 top
D2  83.1,45.58 270 top
D4  73.2,39.68 180 top
D101  88.69,24.87 0 top
D102  36.44,40.2 180 top
D103  36.44,44.52 180 top
D104  65.01,7.31 180 bottom
D105  93.73,22.04 270 top
D106  87.87,16.33 180 top
D107  87.36,12.52 180 top
D108  82.3,8.44 270 top
D109  93.73,14.55 270 top
D110  36.44,36.39 180 top
D112  72.12,28.52 0 top
FID101  88,50.3 0 top
FID102  2,13.8 0 top
FID103  5,5.8 0 top
FID104  94.9,47.3 0 top
IC101  67.81,10.99 0 top
IC102  38.98,4.9 270 top
IC104  87.91,36.62 270 top
IC105  5.83,41.22 270 top
IC107  6.23,22.68 270 top
IC108  46.47,11.5 270 top
IC109  45.84,43.25 0 bottom
IC110  64.12,36.27 180 top
IC111  65.01,46.17 180 top
JP101  67.55,24.96 180 bottom
JP102  87.5,6.15 180 bottom
JP103  36.82,33.85 0 bottom
JP104  67.55,30.8 180 bottom
JP105  67.55,20.14 180 bottom
LED101  34.28,28.05 0 bottom
LED102  34.28,10.55 0 bottom
LED103  34.28,14.05 0 bottom
LED104  34.28,17.55 0 bottom
LED105  34.28,21.05 0 bottom
LED106  34.28,31.42 0 bottom
Q1  4.77,14.76 180 top
Q2  93.57,42.88 0 top
Q3  87.7,40.85 270 top
Q101  22.73,3.88 90 top
Q102  10.15,4.13 90 top
Q103  61.46,16.2 180 top
Q104  88.44,20.26 90 top
Q105  44.18,44.01 90 top
Q106  9.26,31.82 270 top
Q107  73.97,19.44 270 top
R1  17.1,46.8 90 top
R2  12.3,43.5 90 top
R3  14.9,40.4 90 top
R4  8.9,29.1 90 top
R5  62,21.6 0 top
R6  65.16,17.4 180 top
R8  90.23,44.38 180 top
R9  13.9,34.7 0 top
R10  74.17,45.79 0 top
R12  85.09,28.52 0 top
R13  85.09,32.07 180 top
R101  3.16,10.1 270 top
R102  17.26,9.72 180 top
R103  R_user  [R0805']  8.64,13.53 180 top
R104  R_user  [R0805']  3.67,9.6 270 bottom
R105  62.47,3.88 270 top
R106  13.96,14.04 180 top
R107  67.3,4.39 90 top
R108  72.9,10.48 270 top
R109  82.41,40.84 90 top
R110  82.41,37.85 90 top
R111  82.41,34.68 90 top
R112  72.9,13.53 270 top
R113  62.47,9.98 90 top
R114  62.47,6.93 90 top
R115  52.31,14.8 0 top
R116  68.61,16.58 270 top
R117  72.78,16.58 90 top
R119  61.2,24.96 90 top
R120  48.5,29.15 180 top
R121  43.8,3.63 0 top
R122  46.34,3.63 0 top
R123  51.68,3.63 180 top
R124  44.25,18.04 270 top
R125  42.85,20.26 270 top
R126  49.52,24.33 0 top
R127  92.95,18.61 90 bottom
R128  83.68,18.87 90 top
R129  92.95,38.49 90 bottom
R130  47.55,20.26 270 top
R131  40.5,12.26 180 top
R132  37.83,13.6 180 top
R133  37.83,18.17 0 top
R134  47.1,37.66 180 top
R135  69.33,22.55 270 top
R136  87.36,19.12 90 bottom
R137  87.36,39 270 bottom
R138  73.46,23.5 90 top
R140  62.22,30.68 270 top
R141  73.14,35.63 270 top
R142  37.83,8.96 0 top
R143  28.31,25.09 270 top
R144  60.57,39.57 0 top
R145  69.58,37.41 270 top
R146  27.8,48.84 90 top
SJ101  67.04,34.11 180 bottom
SJMP  [SJ']  93.98,38.42 180 top
START  83.81,21.41 0 top
TP1  21.07,7.06 0 top
TP2  12.18,7.69 0 top
TP3  18.21,12.14 0 top
TP4  15.67,17.53 0 top
TP5  18.21,22.93 0 top
TP6  15.67,24.52 0 top
TP7  18.53,30.23 0 top
TP8  15.67,31.5 0 top
TP9  21.07,35.31 0 top
TP10  15.67,37.85 0 top
TP11  21.39,42.3 0 top
TP12  26.47,7.06 0 top
TP13  20.31,45.54 0 top
TP16  26.47,10.55 0 top
TP17  26.47,14.04 0 top
TP18  20.75,17.53 0 top
TP19  31.86,20.07 0 top
TP21  21.07,24.52 0 top
TP22  26.47,28.01 0 top
TP23  26.47,32.14 0 top
TP24  31.55,34.04 0 top
TP25  21.13,37.98 0 top
TP26  20.82,32.58 0 top
U$1  [CE_10.00]  72.63,2.74 0 bottom
U$2  [CE_10.00]  30.47,23.27 0 top
X101  67.36,26.3 270 bottom
X102  7.74,8.96 90 bottom
X103  17.58,50.23 180 bottom

### Tracks (layer width: path | path; a pad name or v marks a point on that pad's centre or on a via)
+10V  (via drill 0.6)  (2 unrouted)
  Top 0.406: 69.33,45.15 66.92,47.57 IC111.3 66.92,50.5 66.55,50.87 64.77,50.87 64.52,50.62 64.52,49.38 IC111.5 | 69.46,45.03 IC111.16 | 67.68,39.19 68.69,38.3 R145.2 | 66.16,45.15 66.03,45.15 65.65,44.77 IC111.13 65.65,41.34 66.41,40.71 67.68,39.57 67.68,39.19 | 66.16,45.15 69.33,45.15 | 69.33,45.15 69.46,45.03 | IC110.4 62.22,37.15 63.23,36.14 v63.74,36.14 64.89,36.14 66.03,34.99 IC110.8 | 69.46,45.03 73,44.79 74.69,44.79 76.2,46.3 81.53,46.3 82.3,45.79 84.59,45.79 85.1,45.28 85.1,39.69 85.27,38.93 85.27,38.38 IC104.1 | v68.44,39.06 67.68,39.06 67.68,39.19 | 66.16,45.15 66.92,46.93 66.92,47.31 67.04,47.31 | R10.2 74.17,43.06 C102.1
  Bottom 0.406: v68.44,39.06 68.44,38.3 66.28,36.14 v63.74,36.14
  pour Top: 64.38,47.57 72.14,47.57 72.38,47.31 72.63,47.06 72.9,46.55 72.89,44.14 70.47,44.14 70.09,44.52 64.5,44.52 64.5,47.44
+12V  (via drill 0.5, 0.6)  (3 unrouted)
  Top 0.35: 10.8,17.47 10.91,16.96
  Top 0.406: IC105.16 9.01,45.66 v9.01,48.46 | R102.1 17.51,10.61 16.75,11.37 R106.1 v16.24,15.56 12.31,15.56 10.91,16.96 | IC102.3 35.78,3.65 34.53,4.9 | R135.1 70.22,23.57 68.82,24.33 | IC107.9 10.17,18.23 10.8,17.47
  Top 0.5: 30.72,30.17 31.86,30.04 36.06,30.04
  Top 0.61: 26.09,7.44 TP12.TP 2.1 29.58,7.05 34.53,4.9 | 26.28,30.04 26.53,30.17 | R102.1 v20.69,9.72 | 68.82,24.33 68.19,24.96 | R109.2 R110.2 R111.2 85.09,34.68 | 85,34.61 85.51,34.44 | 89.66,30.3 89.66,30.87 89.73,32.52 87.12,33.34 85.67,34.29 85.16,34.68 | 89.66,30.3 89.66,28.14 87.38,25.6 86.11,25.6 | 86.11,25.6 84.58,25.6 | 84.58,25.6 84.77,25.85 83.82,25.15 81.28,25.15 80.33,26.11 68.69,26.11 JP101.2 | C2.1 89.53,32.71 89.66,30.3 | R12.2 84.58,25.6 | D101.C 86.14,25.05 86.11,25.6 | 85.09,34.68 85.16,34.68 | 85.16,34.68 IC104.3 | R13.2 85.09,34.68
  Top 0.711: 26.28,30.04 23.48,27.63 | 36.06,30.04 36.82,29.41
  Top 0.813: 23.48,27.63 v22.21,27.63 | 26.53,30.17 30.72,30.17 | 36.82,29.41 41.52,29.41 v43.04,29.15 | 68.19,24.96 JP101.2
  Bottom 0.61: v9.01,48.46 6.85,44.93 6.85,37.28 7.35,36.65 10.53,36.65 14.34,33.85 19.93,29.79 v22.21,27.63 19.16,25.6 19.16,23.95 20.94,21.66 20.94,20.26 20.69,18.23 20.69,16.45 21.83,15.82 21.83,12.9 20.69,11.5 v20.69,9.72 20.82,9.72 23.1,7.44 28.85,7.44 2.1 | JP101.2 65.77,26.87 62.47,26.87 60.82,28.26 60.63,28.52
  Bottom 0.711: 54.03,30.27 59.23,30.27
  Bottom 0.813: v9.01,48.46 X103.1 | 21.45,28.26 21.45,27.38
  Bottom 1.016: v43.04,29.15 50.66,29.15 52.31,29.79 54.03,30.27 | 59.23,30.27 60.63,28.71
+12V1  (via drill 0.6)  (3 unrouted)
  Top 0.406: TP26.TP 21.07,32.96 22.59,33.47 | R119.1 60.31,23.56 59.42,22.41 59.42,19.88 57.9,18.36 57.9,18.3 59.1,17.1 59.3,16.7 59.6,16.2 61.2,16.2 61.46,15.95 | Q103.2
  Top 0.61: 22.66,33.47 v24.12,33.72 | v52.31,17.47 53.09,17.47 53.98,18.36 57.9,18.36
  Bottom 0.406: 22.98,34.74 23.86,35.63 26.53,38.42 27.04,39.69 | 33.07,19.44 33.9,18.89 36.56,18.89 36.95,18.99
  Bottom 0.508: 22.98,34.74 22.21,33.6 | 27.29,19.44 33.07,19.44 | 36.95,18.99 46.72,18.99 52.32,17.48
  Bottom 0.61: 27.29,19.44 25.26,20.58 22.09,22.42 21.2,23.31 21.2,25.47 23.74,27.12 23.74,28.64 21.7,29.66 21.07,30.68 21.07,32.45 22.21,33.6 v24.12,33.72 | 2.11 29.23,41.89 27.04,39.69
GND  (via drill 0.6)
  Top 0.406: IC102.2@1 IC102.2
  Top 1.27: 58.53,28.33 53.14,28.33
  Bottom 0.61: X102.1 3.92,7.69 R104.2
  Bottom 1.27: v44.18,27.25 44.56,27.63 52.95,27.63 53.07,27.76 53.33,27.76 53.84,28.14 54.98,28.14
  other vias: 59.68,32.07 23.48,13.91 13.08,36.5 37.83,11.37 40.5,26.99 7.58,16.36 1.63,35.25 76.06,6.42 34.28,25.98 46.98,8.96 28.05,2.61 15.36,29.03 65.01,23 75.73,50.73 26.15,25.98 29.32,32.45 52.82,42.61 80.51,14.48 23.99,29.79 49.9,35.12 75.43,30.8 72.48,37.43 75.43,43.25 94.48,26.11 52.19,6.8 71.69,24.96 64.89,6.42 25.9,22.04 60.19,35.63 29.96,45.15 39.6,50.43 52.7,50.68 18.96,43.83 8.56,50.33 10.28,34.9 17.75,25.83 14.15,22.33 18.75,19.03 41.58,15.91 41.63,9.2 87.91,15.3 84.71,7.93 91.17,34.49 81.27,45.15 70.95,51.03 59.42,50.74 53.33,35.76 90.67,40.07 75.43,36.9 72.89,30.8 70.98,6.17 1.74,16.62 92.95,22.3 91.43,37.28 31.61,4.9 34.66,6.17 39.87,6.8 75.43,17.66
  pour Top (rank 3): 95.3,52.6 0.7,52.6 0.7,8.2 0.5,7.18 9.89,7.18 13.07,6.8 13.07,0.8 95.3,0.8
  pour Bottom: 0.7,52.6 0.7,0.4 95.5,0.4 95.5,52.6
N$1  (via drill 0.6)  (1 unrouted)
  Top 0.61: 89.65,12.77 88.76,14.17 v83.3,14.17 83.68,14.17
  Top 0.813: 89.65,12.77 D107.1 90.16,11.88 90.16,8.58 90.03,8.45 86.68,8.45 | D108.1 84.15,10.68 86.68,8.45 | 86.68,8.45 86.44,8.35 86.36,7.92 JP102.1
  Top 1.016: 31.23,34.04 30.1,34.22 30.07,34.22 2.9
  Bottom 0.61: 39.36,28.9 41.77,27.76 42.79,24.58 49.65,24.58 52.31,26.31 58.53,26.31 59.42,25.34 59.8,24.33 60.69,21.66 66.28,21.66 67.04,22.17 70.98,22.17 72,21.79 75.43,21.79 76.19,22.42 81.27,22.42 83.55,20.14 83.55,14.42 v83.3,14.17 | 39.36,31.18 38.47,31.95 36.82,33.6 JP103.2
  Bottom 0.813: 39.36,28.9 39.36,31.18 | 2.9 30.54,35.44 36.76,35.44 36.76,33.91 JP103.2
N$2  (via drill 0.6)  (1 unrouted)
  Top 0.406: IC105.10 10.28,38.04 10.78,38.68 11.04,39.3 11.74,40 12.8,40 13.6,40.4 R3.1 | R3.2 15.68,40.31 v16.94,39.71
  Top 0.61: R111.1 79.57,34.99 X101.4
  Bottom 0.305: 75.71,39.06 63.28,43.22 60.02,43.22 58.79,45.79
  Bottom 0.356: 58.79,45.79 52.19,45.79
  Bottom 0.406: 52.19,45.79 50.41,46.17 29.45,46.17 27.42,44.77 27.29,44.65 24.37,43.06
  Bottom 0.61: X101.4 78.15,36.27 75.71,39.06 | 24.37,43.06 19.74,40.27 17.51,39.66 v16.94,39.71 14.97,40.65 11.42,40.65 9.77,41.54 9.77,44.77 11.23,48.01 14.4,48.01 15.04,48.65 X103.2
N$3  (via drill 0.6)  (1 unrouted)
  Top 0.406: IC105.13 10.21,41.85 11.41,43.05 R2.1 | R2.2 13.32,43.63 v14.3,43.63
  Top 0.61: R110.1 79.59,40.2 X101.3
  Bottom 0.356: 59.49,46.48 53.26,46.48
  Bottom 0.406: 74.47,40.39 63.74,44.01 60.76,44.01 59.49,46.48 | 53.26,46.48 47.3,47.7 21.39,47.7 20.24,46.68 17.51,44.39 16.37,44.39 14.88,43.64 | 14,43.63 14.21,43.63 | 14.21,43.63 v14.3,43.63 | v14.3,43.63 14.88,43.64 | 17.26,47.7 15.67,46.11 15.67,44.05 14.88,43.64 | v14.3,43.63 14.21,43.63
  Bottom 0.61: X101.3 77.98,40.39 74.47,40.39 | X103.3 17.58,48.01 17.26,47.7
N$4  (1 unrouted)
  Top 0.406: 2.7 31.23,29.28 34.53,29.28 35.51,28.05
  Top 0.61: TP22.TP 29.2,28.01 2.7 | 35.51,28.05 LED101.A
  Bottom 0.406: 58.73,22.3 54.09,22.3
  Bottom 0.61: X101.8 75.4,20.36 73.14,17.85 68.28,12.99 62.44,12.99 58.73,22.3 | 54.09,22.3 40.12,22.3 35.8,27.76 35.67,27.88 35.48,27.95
N$5
  Top 0.305: 24.12,5.53 16.78,5.53
  Top 0.406: Q101.3 24.12,5.53 | 16.78,5.53 16.24,6.67 16.24,9.21 15.99,9.47
  Top 0.61: 15.99,9.47 R102.2
N$6
  Top 0.406: Q2.1 92.07,40.84 90.68,42.23 90.68,43.55 R8.1
N$7
  Top 0.406: IC101.2 67.17,6.8 68.19,5.79 R107.2
N$8
  Top 1.27: R127.2 R129.1
N$9  (via drill 0.6)
  Top 0.406: v14.21,6.17 13.2,5.66 Q102.3 | 11.29,15.18 v11.42,14.93 | 12.43,14.29 R106.2
  Top 0.61: v11.42,14.93 12.43,14.29
  Bottom 0.406: v11.42,14.93 11.42,15.06 14.97,13.28 16.5,11.5 16.5,8.96 14.21,6.93 v14.21,6.17
N$10
  Top 1.016: 87.38,28.01 87.38,30.17
N$11  (via drill 0.6)
  Top 0.406: Q104.2 85.71,20.58
  Top 0.61: START.TP v85.52,22.74 | Q104.2 93.15,20.26 93.98,20.07 93.34,20.18 D105.2
  Top 0.813: v85.52,22.74 85.71,20.58
  Bottom 0.813: X101.5 79.2,32.24 81.9,29.66 81.9,26.11 83.55,24.33 85.08,22.87 v85.52,22.74
N$12  (1 unrouted)
  Top 0.53: 85.79,4.52 77.27,4.52
  Top 0.61: TP16.TP 2.2 | 85.79,4.52 86.87,3.88 88.9,3.88 91.69,5.66 93.22,5.66 94.54,7.18 94.54,11.25 94.23,11.75 D109.2
  Bottom 0.711: 58.66,6.5 54.47,6.5
  Bottom 0.813: X101.12 78.21,4.51 74.66,4.51 73.78,4.13 60.06,4.13 58.66,6.5 | 54.47,6.5 54.09,6.5 53.2,5.28 38.98,5.28 33.52,8.96 33.64,8.96 LED102.K 2.2
N$13  (1 unrouted)
  Top 0.61: TP17.TP 2.3 | X101.11 80.22,7.72 81.9,6.93 D108.2
  Bottom 0.406: 33.05,15.23 33.52,15.41 37.07,15.41 38.34,17.09
  Bottom 0.61: 33.05,14.04 33.05,15.23 | 38.34,17.09 45.52,17.09 51.68,13.02 52.82,13.02 53.2,12.52 53.2,11.75 54.1,10.47 54.27,10.47
  Bottom 0.711: 54.27,10.47 59.03,10.47
  Bottom 0.813: 2.3 33.05,14.04 | 59.03,10.47 59.44,10.47 59.93,9.85 72,9.85 73.39,8.45 74.56,8.45 X101.11
N$14  (1 unrouted)
  Top 0.61: TP18.TP 23.72,17.53 2.4 | X101.10 77.72,12.44 77.71,12.45 79.44,12.45 79.83,12.52 D107.2
  Bottom 0.406: 37.96,18.1 36.56,16.22 33.39,16.22 33.07,17.53
  Bottom 0.61: 52.19,14.41 46.47,18.1 37.96,18.1
  Bottom 0.711: 58.73,14.41 52.19,14.41
  Bottom 0.813: X101.10 78.2,12.45 76.84,12.45 74.49,10.99 60.63,10.99 58.73,14.41 | 33.07,17.53 25.82,17.55 2.4
N$15
  Top 0.406: Q105.2 43.3,44.01 43.3,43.76
  Top 0.813: IC109.3 43.3,43.76
N$16
  Top 0.406: 45.48,8.96 45.48,7.69 IC108.8 | 45.48,8.96 IC108.6 | 45.48,8.96 45.48,9 46.98,10.5 46.98,16.07 47.99,17.47 48.25,17.47 48.5,17.72 49.77,19.25 49.77,21.41 49.39,21.79 48.63,21.79 47.49,22.55 47.49,26.49 48.5,27.5 R120.1
N$17  (1 unrouted)
  Top 0.406: IC105.12 10.21,40.58 11.86,42.2 14.55,42.2 16.21,43.78 16.21,43.89 R1.1 | R1.2 20.12,48.73 X103.4
  Top 0.61: R109.1 81.41,41.09 79.12,43.38 78.6,43.88 X101.2
  Bottom 0.406: 64.5,44.77 61.47,44.77 59.69,48.33 58.53,49.83 54.41,49.83 46.6,48.52 20.43,48.52
  Bottom 0.61: X101.2 78.13,44.2 75.55,41.66 74.03,41.73 71.11,42.49 67.93,43.76 64.5,44.77 | X103.4 20.43,50.23 20.43,48.52
N$18
  Top 0.406: IC105.15 7.1,44.39 6.21,43.38 6.21,35.88 5.85,34.89 5.85,23.57 4.71,22.04 IC107.5
N$19
  Top 0.406: 26.61,31.99 26.7,31.18 32.82,31.18 32.82,31.36 LED106.K | 33.01,35.14 34.2,36.03 D110.2
  Top 0.61: LED106.K 33.01,35.14
  Top 1.016: 2.8 TP23.TP 26.61,31.99
  Bottom 0.61: 33.13,45.03 30.91,40.33 29.64,40.33 28.88,39.57 28.5,39.06 25.71,36.2 25.71,32.84 | 24.73,31.82 2.8
  Bottom 0.813: X101.14 52.42,44.12 50.28,45.03 33.13,45.03 | 25.71,32.84 24.73,31.82
N$20  (via drill 0.81)  (1 unrouted)
  Top 0.813: 31.61,37.03 32.5,38.17 36.06,38.17 v36.95,38.8 38.72,40.18
  Top 1.016: 1.9 20.81,35.05 TP9.TP 25.06,35.49 26.79,36.9 30.72,36.9 31.61,37.03
  Bottom 0.813: X101.17 53.37,32.24 52.69,31.95 51.04,31.06 50.03,30.55 42.66,30.55 41.14,32.2 41.14,36.65 v36.95,38.8
N$21  (via drill 0.6)
  Top 0.61: 30.66,43.76 32.31,46.17 36.86,46.17 37.85,45.03 38.72,44.52 | 38.72,44.52 38.72,42.74 40.82,41.34 40.82,32.45 39.67,31.38 v37.39,30.87 | D103.1 38.72,44.52
  Top 1.016: 30.66,43.76 27.67,43.76 26.09,42.3 TP11.TP 21.07,41.98 19.2,41.98 1.11
  Bottom 0.61: X101.19 53.02,24.32 50.53,23.44 41.07,23.44 37.39,27.76 v37.39,30.87
N$22  (1 unrouted)
  Top 0.406: IC111.11 63.11,44.55 62.75,45.05 60.5,45.05 60.38,45.5 | 60.38,45.5 60.57,44.9 IC111.9 | 60.38,45.5 59.17,46.11 58.74,46.09 54.09,46.09 | R146.2 29.26,48.84 30.5,47.6 36.93,47.6 38.68,47.07 51.25,47.07 54.1,46.1
N$23  (via drill 0.6)
  Top 0.406: X101.22 54.34,12.44 52.13,10.03 52.13,8.63 54.09,6.5 59.42,6.5 60.64,4.96 | 60.64,4.96 R105.2 | v59.8,7.94 59.42,6.54 60.64,4.96
  Bottom 0.406: D104.C 62.34,7.31 62.34,7.44 61.84,7.94 v59.8,7.94
N$24  (1 unrouted)
  Top 0.406: 69.71,2.86 64.76,2.86 64,3.88 R105.1 | IC101.3 68.44,7.06 69.84,5.66 69.84,4.39 | 69.84,4.39 69.84,2.86 | C101.1 69.84,4.39
N$25
  Top 0.406: IC107.13 10.91,23.31
  Top 0.61: TP6.TP 12.97,24.52 1.6 12.43,24.58 11.8,24.2 10.91,23.31
N$26
  Top 0.406: 1.7 15.73,26.53 11.93,26.49 10.53,24.58 IC107.14
  Top 0.61: TP7.TP 18.53,28.14 1.7
N$27
  Top 0.61: D1.2 82.36,27.82 83.82,29.28 84.96,29.28 R12.1 R13.1
N$28  (via drill 0.6)
  Top 0.406: v35.55,23.82 34.66,23.44 25.9,23.44 24.78,24.55 2.6 | v52.57,20.64 54.34,22.42 58.41,22.42 59.17,23.58 59.17,26.23 62.73,26.23 63.23,26.4 65.84,26.4 66.35,25.85 66.35,21.66 | JP105.2 67.42,20.14
  Top 0.61: TP21.TP 23.7,24.52 2.6 | 67.42,20.14 66.35,21.66
  Bottom 0.406: v52.57,20.64 51.04,20.64 50.79,20.9 39.36,20.9 v35.55,23.82
N$29
  Top 0.61: JP101.1 R119.2
N$30
  Top 0.406: R122.2 C105.1 50.28,4.51 | IC108.9 50.41,8.83 50.91,8.2 50.91,6.04 50.28,5.4 50.28,4.51 | 50.28,4.51 R123.2
N$31
  Top 0.406: IC108.14 49.65,15.38 49.65,16.58 51.17,18.61 51.17,22.68 50.53,23.44 | R126.2 50.53,23.44 | 50.53,23.44 C106.2
N$32
  Top 0.406: R8.2 89.9,45.27 88.9,44.52 88.9,42.04 Q3.3
N$34
  Top 0.61: LED101.K 31.38,26.65 R143.1
N$35
  Top 0.406: R120.2 48.5,33.51 IC109.1
  Top 0.61: R134.1 48.4,36.16 IC109.1
  Bottom 0.711: 53.84,34.21 59.36,34.21
  Bottom 0.762: 63.36,28.44 69.84,28.44
  Bottom 0.813: 53.84,34.21 51.42,33.09 IC109.1 | 62.62,32.18 63.36,28.44
  Bottom 1.016: 59.36,34.21 62.62,32.18 | X101.7 78.12,24.22 75.52,24.22 74.66,25.47 72.89,26.23 69.84,28.44
N$36  (1 unrouted)
  Top 0.406: R126.1 51.04,26.99 51.04,38.93 48.98,42.51 46.42,42.51
N$37  (via drill 0.6)
  Top 0.406: IC105.2 4.24,44.39 v5.83,47.57 | IC107.7 5.21,19.5 v5.47,19.75
  Bottom 0.406: 5.83,46.93 4.56,45.28 4.56,34.36 5.01,33.81 5.01,31.65 1.66,31.18 1.66,19.75 v5.47,19.75
  Bottom 0.61: v5.83,47.57 5.83,46.93
N$38
  Top 0.406: 1.3 17.89,14.56 17.89,17.72 16.37,19.25 13.83,19.25 10.55,20.77 IC107.11
  Top 0.61: TP3.TP 18.21,13.82 1.3
N$39
  Top 0.406: 1.5 15.85,21.05 15.74,21.15 13.45,21.15 12.94,21.41 12.05,21.41 10.55,22.04 IC107.12
  Top 0.61: 1.5 18.44,22.7 TP5.TP
N$41
  Top 0.61: LED102.A 35.55,10.23 36.06,9.72 37.64,9.72 R142.1 | LED103.A LED104.A LED105.A
  Bottom 0.508: 31.61,26.87 31.61,28.9
  Bottom 0.61: LED102.A LED103.A | 31.61,26.87 31.61,26.49 33.77,22.8 LED105.A | 31.61,28.9 32.5,30.04 34.04,30.04 LED106.A
N$42
  Top 0.406: X101.16 58.47,36.2 58.53,36.14 61.08,31.95 61.08,31.31 R140.2
N$43
  Top 0.406: R128.2 85.59,18.61 89.14,18.62 Q104.1
N$44  (via drill 0.6, 0.8 pad 1.68)
  Top 0.406: IC107.2 IC107.1 2.8,27.78 2.8,30.05 | 2.8,30.05 2.8,33.06 5.32,36.01 5.32,42.23 4.43,43.12 IC105.3 | Q106.1 8.29,33.37 v8.29,34.53 | v3.59,30.05 2.8,30.05 | Q1.1 5.65,17.16 v6.35,17.85
  Bottom 0.406: v8.29,34.53 5.7,30.05 | 5.7,30.05 v3.59,30.05 | v6.35,17.85 6.86,18.36 6.86,28.89 5.7,30.05
N$45
  Top 0.406: C107.1 43.62,21.38 R125.1 R130.2
N$46  (via drill 0.6)
  Top 0.406: 45.71,11.5 46.22,12.26 46.22,16.58 47.74,18.61 48.37,19.37 R130.1 48.12,21.05 C108.1 | 45.71,11.5 IC108.4 | IC108.10 49.3,10.2 50.5,10.2 51,9.7 v51.1,9.7 | v45.7,10.9 v45.71,10.91 45.71,11.5
  Bottom 0.406: v51.1,9.7 49.9,10.9 v45.7,10.9
N$47  (via drill 0.6)
  Top 0.406: R133.2 R132.2 38.6,14.17 39.1,13.66 39.1,12.01 R131.1 41.52,10.99 41.6,10.23 | IC108.5 41.6,10.23 | IC108.11 v51.2,11.5 | v41.7,10.9 41.6,10.7 41.6,10.23
  Bottom 0.406: v51.2,11.5 49.3,12.4 42.9,12.4 41.7,11 v41.7,10.9
N$48
  Top 0.406: R138.2 74.47,22.55 74.47,20.14 Q107.3
N$49  (via drill 0.6)
  Top 0.406: IC111.7 61.84,47.2 v62.23,46.81 | Q3.1 86.69,42.92 v86.61,43
  Bottom 0.406: v62.23,46.81 64.77,46.81 65.28,46.3 75.44,46.3 75.69,46.04 80.26,46.04 80.77,46.55 83.31,46.55 86.61,43.25 v86.61,43
N$50  (via drill 0.6)
  Top 0.406: IC107.4 4.52,23.31 4.96,23.95 4.96,30.36 v4.07,32.71
  Top 0.61: v3.29,47.07 3.29,45.66 IC105.1
  Bottom 0.406: v4.07,32.71 3.74,32.71 3.68,32.76
  Bottom 0.61: 3.68,32.76 3.67,32.9 3.67,46.66 v3.29,47.07
N$51
  Top 0.61: R115.1 54.28,16.33 X101.21
N$52
  Top 0.406: 9.28,27.12 IC107.16 10.02,27.12 10.9,28 10.9,30.3 10.3,30.9 10.3,31.79 Q106.3 | Q106.3 10.28,32.27 11.2,33.4 12,34.4 12.3,34.4 R9.1 | 10.2,31.75 Q106.3
N$53  (via drill 0.6)
  Top 0.61: TP25.TP 23.8,38.49
  Top 0.813: v30.59,38.49 23.8,38.49 2.10
  Bottom 0.813: X101.15 36.56,43.06 34.28,43.06 32.5,39.19 31.1,38.49 v30.59,38.49
N$54
  Top 0.813: D106.1 91.28,14.22 91.69,13.78
  Top 1.27: 91.69,13.78 91.69,9.85 R127.1
N$55
  Top 0.61: TP19.TP 31.86,20.16 30.98,21.05 2.5 | X101.9 80.2,16.07 85.02,16.07 D106.2
  Bottom 0.406: LED105.K 34.22,19.73 36.44,19.73 36.82,20.01 | 53.93,18.33 57.17,18.33 58.92,18.36
  Bottom 0.61: 2.5 LED105.K | 36.82,20.01 47.08,20.01 50.28,19.25 52.06,19.25 53.74,18.33 53.93,18.33 | X101.9 78.08,16.33 73.9,16.33 69.33,12.01 61.71,12.01 58.92,18.36
N$56  (1 unrouted)
  Top 0.406: IC105.14 7.74,43.12 7.1,42.49 7.1,35.63 6.74,34.61 6.74,23.06 4.83,20.77 3.06,20.77
N$57  (via drill 0.6)  (2 unrouted)
  Top 0.406: Q101.1 24.12,2.36 13.91,2.36 Q102.1 | 8.62,10.23 X102.2
  Top 0.61: 5.83,10.23 X102.2 8.84,12.1 R103.1 | 5.83,10.23 v5.51,10.29 | 5.83,10.23 3.99,10.23 R101.1 | 9.89,8.71 8.62,10.23 | Q102.1 12.33,3.88 Q102.2 | 9.89,4.13 6.72,4.13 | 9.13,2.36 9.13,4.39 | 8.37,3.88 8.37,5.91
  Top 0.813: 9.89,4.13 9.89,8.71
  Bottom 0.61: X102.2 v5.51,10.29 3.92,10.55 | 3.54,10.67 R104.1
  pour Top: 13.2,6.42 2.02,6.42 2.02,0 13.2,0
N$58
  Top 0.406: 1.8 12.89,31.5 | 15.67,31.38 TP8.TP 15.69,31.52 | R9.2 15.1,34.4 15.1,31.5
  Top 0.61: TP8.TP 15.1,31.5 12.99,31.5 | 12.81,31.5 12.99,31.5 | 12.99,31.5 1.8
N$59  (1 unrouted)
  Top 0.406: Q101.2 16.5,3.88 14.97,7.44 12.43,7.44 TP2.TP
  Top 0.61: TP2.TP 12.3,9.72 12.3,10.36 1.2 | 21.07,3.25 19.67,3.25 | 21.07,4.77 19.67,4.77
  pour Top: 23.86,5.15 17.01,5.15 15.74,6.42 15.48,11.75 10.66,11.75 10.4,10.74 10.66,8.71 13.2,6.67 13.2,6.42 13.83,5.91 13.83,2.1 23.86,2.1
N$60  (via drill 0.6)
  Top 0.406: Q107.1 70.6,18.48 68.76,18.48 | 68.76,18.48 68.31,18.48 68.06,18.36 66.92,18.36 66.54,18.61 65.9,19.75 | v64.5,14.29 62.98,12.01 60.06,12.01 58.28,14.04 54.34,14.04 53.48,12.84 51.46,12.84 51.1,13.3 51.1,13.6 50.6,14.1 49.33,14.1 IC108.13 | R135.2 68.5,21.66 68.76,21.28 68.76,18.48
  Top 0.813: 65.9,19.75 JP105.1
  Bottom 0.406: v64.5,14.29 64.76,17.34 JP105.1
N$61  (1 unrouted)
  Top 0.305: 3.18,24.58 1.53,24.58 1.53,28.01 1.91,28.52
  Top 0.406: 1.91,28.52 1.91,33.64 4.48,36.33 4.48,39.31 IC105.6
N$64
  Top 0.61: IC109.2 R134.2
N$65
  Top 0.406: R144.2 60.57,37.28 61.33,36.39 62.22,35.32 IC110.5
N$67
  Top 0.406: IC107.10 10.55,19.5 11.18,18.99 12.05,18.44 1.4
  Top 0.61: TP4.TP 12.96,17.53 1.4
N$69  (via drill 0.6)
  Top 0.61: TP1.TP 1.1
  Top 0.813: D2.2 82.53,43.26 v81.52,43.31
  Bottom 0.61: 36.25,2.93 30.09,2.93
  Bottom 0.813: v81.52,43.31 82.41,43.01 82.45,36.5
  Bottom 1.016: 82.45,36.5 90.41,30.49 90.41,12.9 85.2,12.9 82.92,11.12 82.92,3.31 82.03,1.72 52.38,1.72 49.26,2.48 39.87,2.48 36.25,2.93 | 30.09,2.93 28.25,4.58 22.57,4.58 1.1
N$83
  Top 0.406: 44.95,4.64 44.95,6.04 IC108.7 | 46.03,4.83 R122.1 46.22,4.64 44.95,4.64 | 44.95,4.64 43.93,4.64 R121.1
N$84
  Top 0.406: Q106.2 8.77,30.93 9.5,30.2 9.5,29.39 R4.2
N$85  (1 unrouted)
  Top 0.406: Q103.1 63.24,16.86 65.15,16.58 R116.2
N$86
  Top 0.406: R144.1 60.95,40.71 63.49,40.71 | 63.49,40.71 IC110.3 | 63.49,40.71 64.38,41.6 IC111.12 64.38,46.67 65.53,47.82 65.53,49.13 IC111.4
N$87
  Top 0.406: R140.1 63.11,28.96 68.44,28.96 69.33,28.64 D112.1
N$88  (via drill 0.6)
  Top 0.406: IC107.15 9.43,25.72 10.31,25.92 11.37,27.19 v11.93,28.26 | R128.1 v81.27,18.61
  Bottom 0.406: v11.93,28.26 14.47,26.49 15.48,26.49 16.24,25.72 16.24,22.93 15.48,22.17 15.48,20.64 19.29,16.83 19.29,16.33 20.82,14.8 20.82,13.41 19.04,11.63 19.04,9.72 23.1,5.66 29.2,5.66 31.23,3.75 35.43,3.75 36.07,4.26 51.82,4.26 53.47,2.99 53.45,2.99 53.84,2.74 81.01,2.74 81.78,3.88 81.78,17.6 v81.27,18.61
N$89
  Top 0.406: IC111.14 66.92,41.6 69.58,39.95 69.58,38.55 R145.1 | 70.47,37.15 R145.1 | C110.1 68.69,35.12 70.47,36.52 R145.1
N$90
  Top 0.406: TP13.TP 23.73,45.54 2.12 23.99,45.81 23.99,46.93 25.9,48.84 R146.1
N$91
  Top 0.813: X101.1 80.38,48.08 81.1,48.04 83.06,48.04 D2.1
N$92
  Top 0.406: IC101.1 65.9,9.85 66.54,10.48 R108.2
N$93  (via drill 0.6)
  Top 0.813: D103.2 35.25,42.36 D102.2 34.28,40.2 v35.42,41.73
  Top 1.016: 1.10 TP10.TP 18.02,37.92 19.54,39.43 22.4,40.39 26.15,40.39 26.47,40.07 32.25,40.07 32.75,42.36
  Top 1.93: 32.75,42.36 35.25,42.36
  Bottom 0.61: 63.73,34.11 63.73,33.84 | SJ101.1 65.01,34.11 64.24,33.33
  Bottom 0.711: 54.22,38.17 59.55,38.17
  Bottom 0.813: v35.42,41.73 36.82,41.73 54.22,38.17 | 59.55,38.17 63.36,34.21 63.73,33.84 64.24,33.33 65.01,32.56 JP104.1
N$94
  Bottom 0.61: 69.49,33.72 68.6,34.11 SJ101.2
  Bottom 0.813: 87.36,28.9 R136.2 | 87.36,28.9 R137.2 | JP104.2 67.55,31.82 69.49,33.72 69.97,34.23 81.39,34.23 86.6,28.9 87.36,28.9
N$95  (via drill 0.6)
  Top 0.813: D109.1 93.73,16.58 v94.23,15.82
  Bottom 0.813: v94.23,15.82 94.23,15.56 94.49,14.04 94.49,11.5 94.74,11.25 94.74,7.94 91.44,4.64 89.02,4.64 JP102.2
N$96
  Top 0.406: C103.1 R108.1 R112.1
N$97  (1 unrouted)
  Top 0.406: IC101.5 69.9,13.59 70.73,14.42 | 70.73,14.42 71.36,15.06 | R112.2 71.87,13.28 70.73,14.42 | Q1.3 4.72,13.79 3.81,13.79 2.35,12.32 1.33,12.32 0.76,11.75 0.76,8.2 1.27,7.69 2.54,7.69 3.81,6.42 3.81,5.15 7.62,1.34 29.72,1.34 31.5,3.12 34.29,3.12 35.81,1.34 74.68,1.34 74.93,1.59 74.93,15.06 73.66,15.06 | 73.66,15.06 71.42,15.06 | R117.2 73.66,15.06
N$98
  Top 0.406: 38.22,36.12 38.68,36.12 D110.1
  Top 0.61: JP103.1 39.36,35.71 D110.1
N$99
  Top 0.406: 71.23,21.03 71.62,21.91 R138.1
  Top 0.813: 71.23,21.03 JP105.3
N$100
  Top 0.406: Q103.3 60.1,18.52 60.1,19.4 60.73,20.03 R5.1
N$101
  Top 0.406: R113.1 61.58,9.34 63.23,7.94 63.23,7.82 R114.2 63.36,7.94 64.76,9.21 64.76,10.74 65.52,11.5 67.81,11.5 68.31,12.01 68.31,13.46 IC101.6
N$102
  Top 0.305: 67.04,32.58 66.54,32.07 63.81,32.07 63.49,32.45
  Top 0.406: IC110.2 64.76,37.53 67.04,35.25 67.04,32.58 67.93,32.58 68.69,32.14 70.43,32.14 72.02,29.96 72.78,29.41 D112.2 74.03,29.24 C109.2 R141.1 74.16,36.39 74.18,37.66 75,38.48 D4.C | 63.49,32.45 IC110.6
N$103
  Top 0.406: IC111.2 68.33,49.24 68.33,47.82 68.83,47.31 69.85,47.31 70.87,48.33 71.5,48.33 C15.2 72.52,48.46 73.15,47.82 74.17,47.19 R10.1
N$104
  Top 0.406: SJMP.2 93.22,39.44 93.47,39.69 93.47,40.86 Q2.2
  Top 0.813: Q2.2 93.53,45.41 93.4,45.92 R129.2
N$107
  Top 0.406: IC101.7 67.31,13.73 67.31,14.8 | 67.31,14.8 67.82,15.31 69.09,15.31 R116.1 R117.1 | R115.2 52.96,13.91 53.85,14.8 58.67,14.8 60.45,12.77 62.48,12.77 63.25,13.91 63.25,14.93 63.5,15.31 66.8,15.31 67.31,14.8
N$108
  Top 0.406: 38.22,19.12 R133.1 38.94,19.06 39.3,18.7 39.3,16.7 42,14 43.63,14 IC108.2
N$580  (1 unrouted)
  Top 0.406: IC108.1 43.68,16.45 43.3,17.53 R124.2 43.3,18.87 42.53,19.25 42.28,19.37 R125.2
V+  (via drill 0.6)  (2 unrouted)
  Top 0.305: 95.17,31.43 95.2,31.55
  Top 0.406: 49.01,44.9 48.77,44.9 47.75,45.54 46.39,45.54 Q105.3 | 95.2,31.55 95.2,37.78 95.21,37.74 95.12,38.41 95.11,38.42 95,38.42 | 95.06,38.49 95,38.42 | 95,38.42 SJMP.1 95.06,38.75 Q2.3
  Top 0.55: 66.8,27 76.2,27 77.19,27.99
  Top 0.61: Q104.3 90.7,21.76 89.53,22.61 | 89.53,22.61 v89.22,22.61 | 95.17,31.43 92.39,31.18 90.81,29.6 90.81,27.69 89.53,26.42 89.53,22.61 | D1.1 79.11,28.28 | 58.6,30.2 61.41,27.49 arc45 61.51,27.4 66.4,27.4 66.8,27 | 77.19,27.99 arc-45 77.89,28.28 78.9,28.28
  Top 0.813: 49.01,44.9 51.27,40.73 52.06,39.46 52.06,31.2 54.21,30.29 arc45 54.42,30.2 58.6,30.2
  Bottom 0.61: v89.22,22.61 85.09,21.34 79.11,27.32 79.11,28.28 X101.6
VCC  (via drill 0.6)
  Top 0.406: R124.1 45.26,17.53 45.43,16.45 45.43,12.77 IC108.3 41.64,12.77 41.14,13.28 41.07,13.28 R131.2 | R121.2 42.41,3.63 42.41,6.29 41.27,7.43 41.27,7.56 | IC102.1 36.47,7.03 35.93,7.44 | R113.2 63.36,11.25 | 63.36,11.25 65.01,13.53 65.84,13.53 IC101.8 | 63.36,11.25 60.57,11.25 59.17,10.48 53.84,10.48 v53.07,9.21 | 6V.TP 32.63,8.58 33.71,7.5
  Top 0.61: v40.12,14.42 R131.2 | 35.93,8.2 37.83,8.2 | 37.83,8.2 39.36,8.2 | C104.1 33.71,7.5 33.77,7.44 35.93,7.44 | R142.2 37.83,8.2
  Top 0.813: 35.93,7.44 35.93,8.2 | 39.36,8.2 40.63,8.2 | 40.63,8.2 v40.5,8.33 | 41.27,7.56 40.63,8.2
  Bottom 0.406: v53.07,9.21 52.22,8.01 49.26,7.94 48.88,7.56 41.75,7.56 40.99,8.33 v40.5,8.33
  Bottom 0.61: v40.5,8.33 40.5,13.91 v40.12,14.42

### Text on the board
Top: BEP V3.3 / maru-labs.com | top
Bottom: BEP V3.3 / maru-labs.com
tPlace: 4 | 2 | 3 | 1 | QC | b | c | 5 | a | 5 | 4 | 3 | 1 | 2
bPlace: QC
tNames: N | 78L10 | BSS138 | N | BSS138 | BSS138 | GND / / <> / / N / / G4 / / G2 / / CC | < / / > / / G5 / / G3 / / G1 / / / BAT
bNames: GND c b a 12V | GND / BT / HiB | BL <> / Resistor | RPM | RPM / SPD / HiB | WRN | 18 | enable / Bulb Test / on WRN / ON / OFF | 2.7 / 2.6 | 19 | 1.12 GND / 1.11< / 1.10<> / 1.9 > / 1 8 N / 1.7 G5 / 1.6 G4 / 1.5 G3 / 1.4 G2 / 1.3 G1 | enable / Choke / on WRN | 1.2 CC | 1 BAT / 2 GC / 3 GB / 4 GA / 5 Start / 6 SWP / 7 RES / 8 ABS / 9 ALT / 10TMP / 11 OIL | ALT / TMP / OIL / CHK / SWP | 1.1 BAT | OFF/ ON | 2.12 / 2.11 / 2.10 / / / / / 2.5 / 2.4 / 2.3 / 2.2 / 2.1 | CHK | 13 / 14 / 15 / 16 / 17 / / / / 21 SPDin / 22 SPDout / 23 / 24
tValues: M7 | M7 | SS12 | M7 | M7 | M7 | 2.4/1.1V | 6,8 | M7 | 4 | SS12 | SS12 | RPM / / HiB / / BT / / BAR / / TMP / / CHK | SPD / / WRN / / ABS / / ALT / / OIL / / SWP | 6V | SS12 | BA | 13 GND / 14 BT / 15 HiB / 16RPM / 17 > / 18 GND / 19 < / / SPDin / SPDout / 23 GND | 1 BAT / 2 GC / 3 GB / 4 GA / STRT / 6SWP / 7RES / 8 ABS / ALT / TMP / 11OIL / 12CHK | BA | 4.7V
bValues: 2.2 kOhm / SPD / Pull-up / (Middle / Switch ) | OFF ON | BT | > | ABS | OFF/ ON | BAR/RES | > | BAR/RES | Mode / Selector
tStop: BEP V3.3 / maru-labs.com
bStop: BEP V3.3 / maru-labs.com